# Altium project PicoHAL.PrjPCB
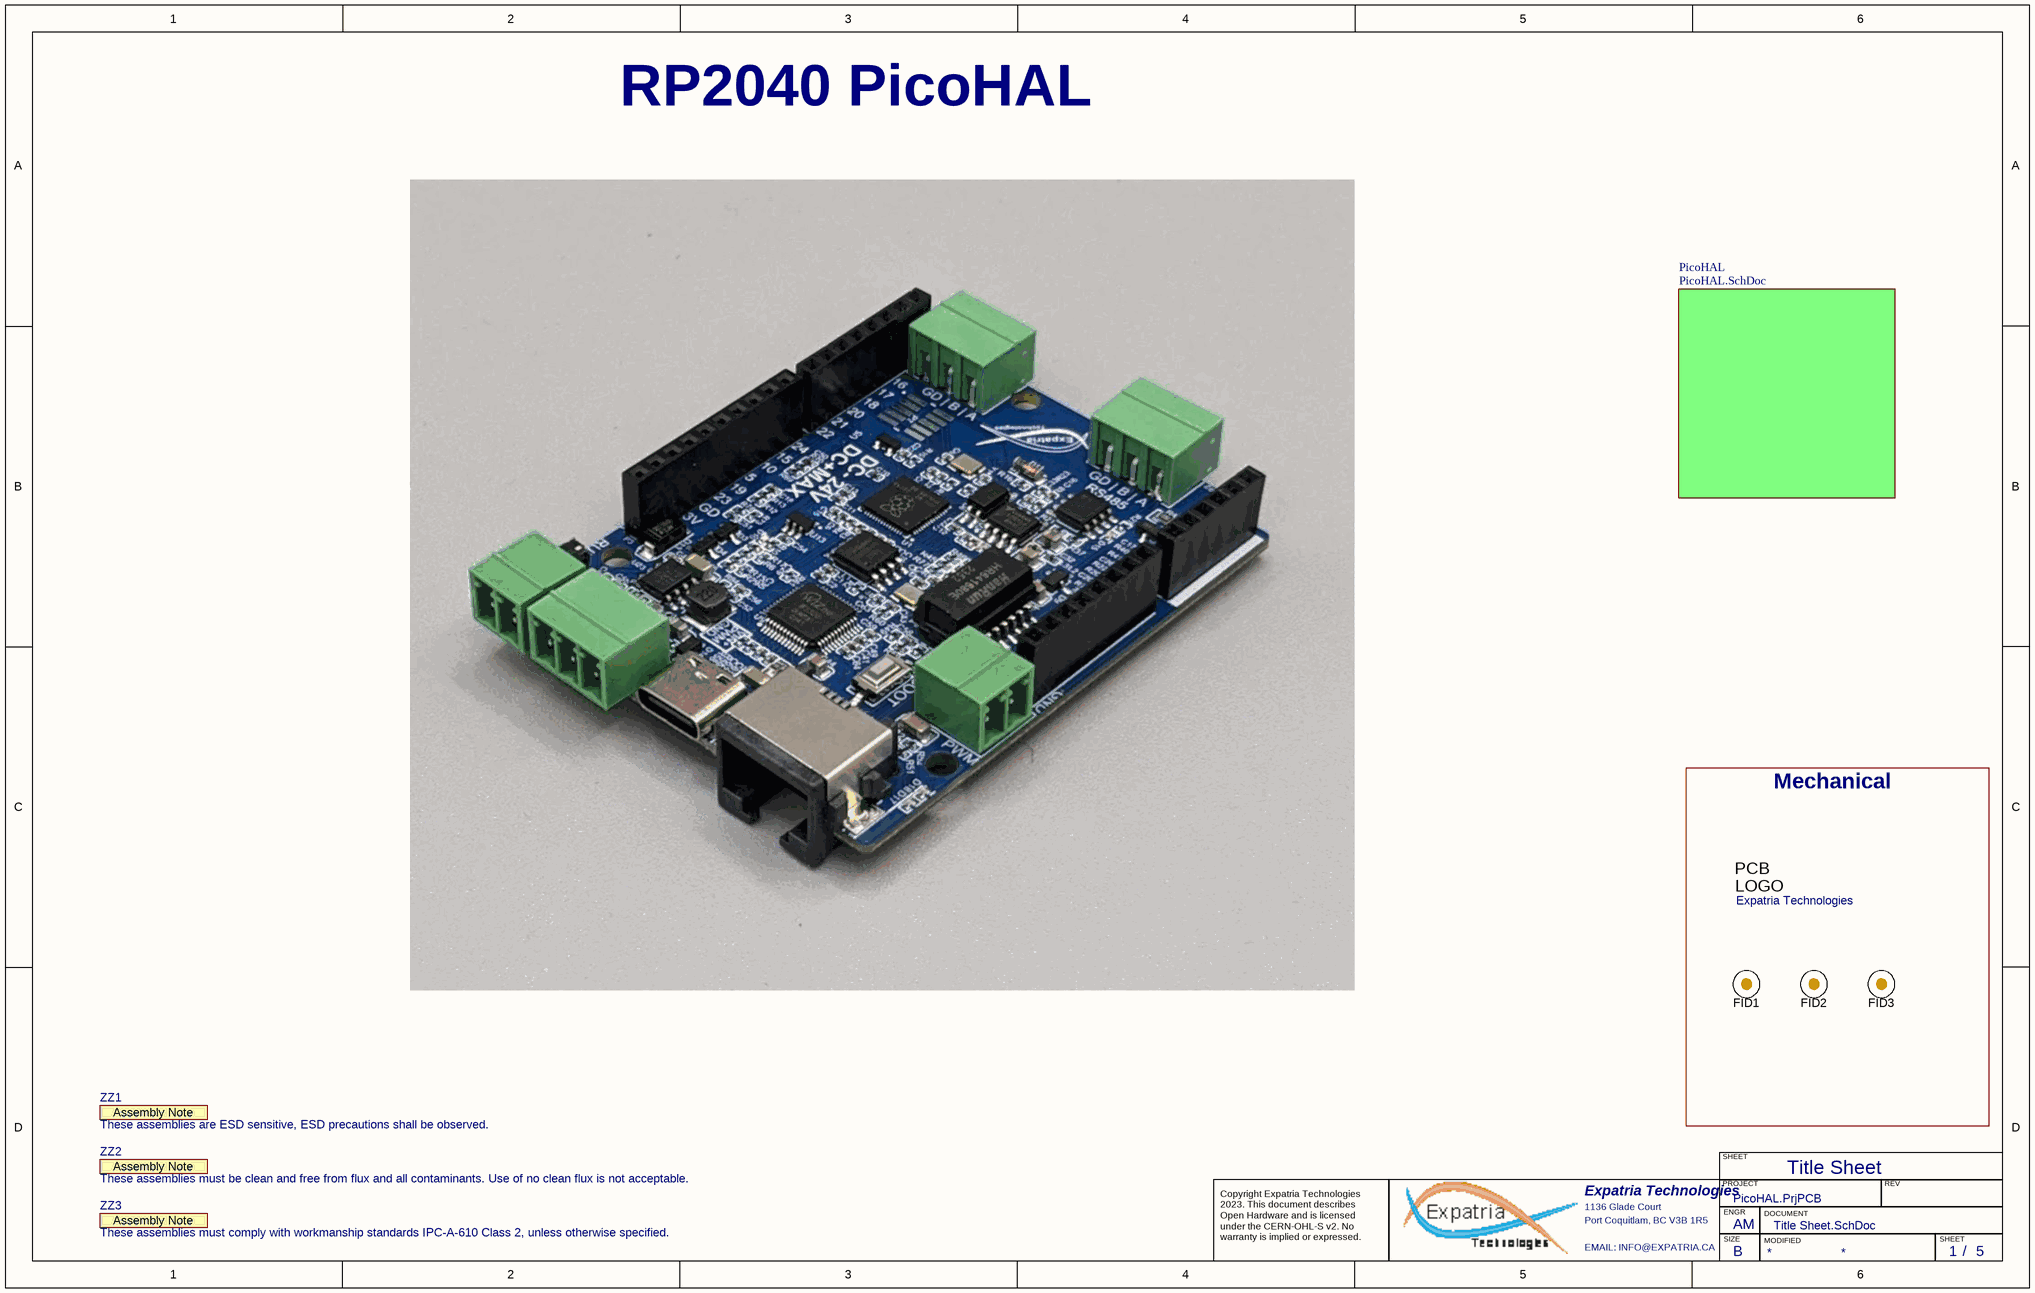
[diagram p0: Title Sheet.SchDoc]
VarRevNo: A10; Title: PicoHAL; PCBREVNO: A10; PCBPARTNO: PicoHAL
5 sheets, 178 parts. Net scope: hierarchical (ports join the sheet entries above them; power ports are global).
Board file: PicoHAL.pcbdoc
Sheets:
  Title Sheet.SchDoc
    PicoHAL = PicoHAL.SchDoc
      MODBUS = RS485.SchDoc
      5V_Supply = 5V_Power_Supply.SchDoc
      ET = W5500_Module.SchDoc

## Sheet Title Sheet.SchDoc: RP2040 CNC
size B; Author: AM; CompanyName: Expatria Technologies; DrawnBy: A.Marles; Engineer: AM; Organization: Expatria Technolgoies; Address1: Schematic; DocumentNumber: 1; Revision: A10; SheetNumber: 1; SheetTotal: 5

### Parts
FID1  Fiducial  [Fiducial10-20]  (value not drawn)  (no BOM)
FID2  Fiducial  [Fiducial10-20]  (value not drawn)  (no BOM)
FID3  Fiducial  [Fiducial10-20]  (value not drawn)  (no BOM)
Logo1  Expatria Technologies  [Expatria-Logo]  (no BOM)
ZZ1  These assemblies are ESD sensitive, ESD precautions shall be observed.  [AssemblyNote]  (graphical)
ZZ2  These assemblies must be clean and free from flux and all contaminants. Use of no clean flux is not acceptable.  [AssemblyNote]  (graphical)
ZZ3  These assemblies must comply with workmanship standards IPC-A-610 Class 2, unless otherwise specified.  [AssemblyNote]  (graphical)

### Blocks framed on the sheet
Mechanical: FID1-FID3 Logo1

### Sub-sheets
PicoHAL = PicoHAL.SchDoc: no entries

### Notes on the sheet
- RP2040 PicoHAL
- Title Sheet
- SHEET
- Expatria Technologies
- 1136 Glade Court
- Port Coquitlam, BC V3B 1R5
- PROJECT
- SIZE
- ENGR
- MODIFIED
- DOCUMENT
- REV
- Copyright Expatria Technologies 2023. This document describes Open Hardware and is licensed under the CERN-OHL-S v2. No warranty is implied or expressed.
- EMAIL: INFO@EXPATRIA.CA
- B
- /
- (in symbol AssemblyNote) Assembly Note
- (in symbol SBT-Logo) PCB; LOGO

### Library data of the parts
FID1-FID3 = Fiducial: FIDUCIAL NO ASSEMBLY; Manufacturer 1: NONE; Manufacturer Part Number 1: NONE; Value: Fiducial
Logo1 = SBT-Logo: Manufacturer 1: NONE; Value: Expatria Logo; Manufacturer Part Number 1: NONE
ZZ1-ZZ3 = AssemblyNote: SymbolCreator: codlsc; SymbolVersion: 2010-05-18; CompType: AssemblyNote; ClassName: AssemblyNote; Publisher: Texas Instruments; LatestRevisionDate: 2012-06-14; LatestRevisionNote: Initial Version; Alternate Manufacturer: -; Alternate PartNumber: -

## Sheet PicoHAL.SchDoc: RP2040 CNC
size C; Author: AM; CompanyName: Expatria Technologies; DrawnBy: A.Marles; Engineer: AM; Organization: Expatria Technolgoies; Address1: Schematic; DocumentNumber: 2; Revision: A10; SheetNumber: 2; SheetTotal: 5
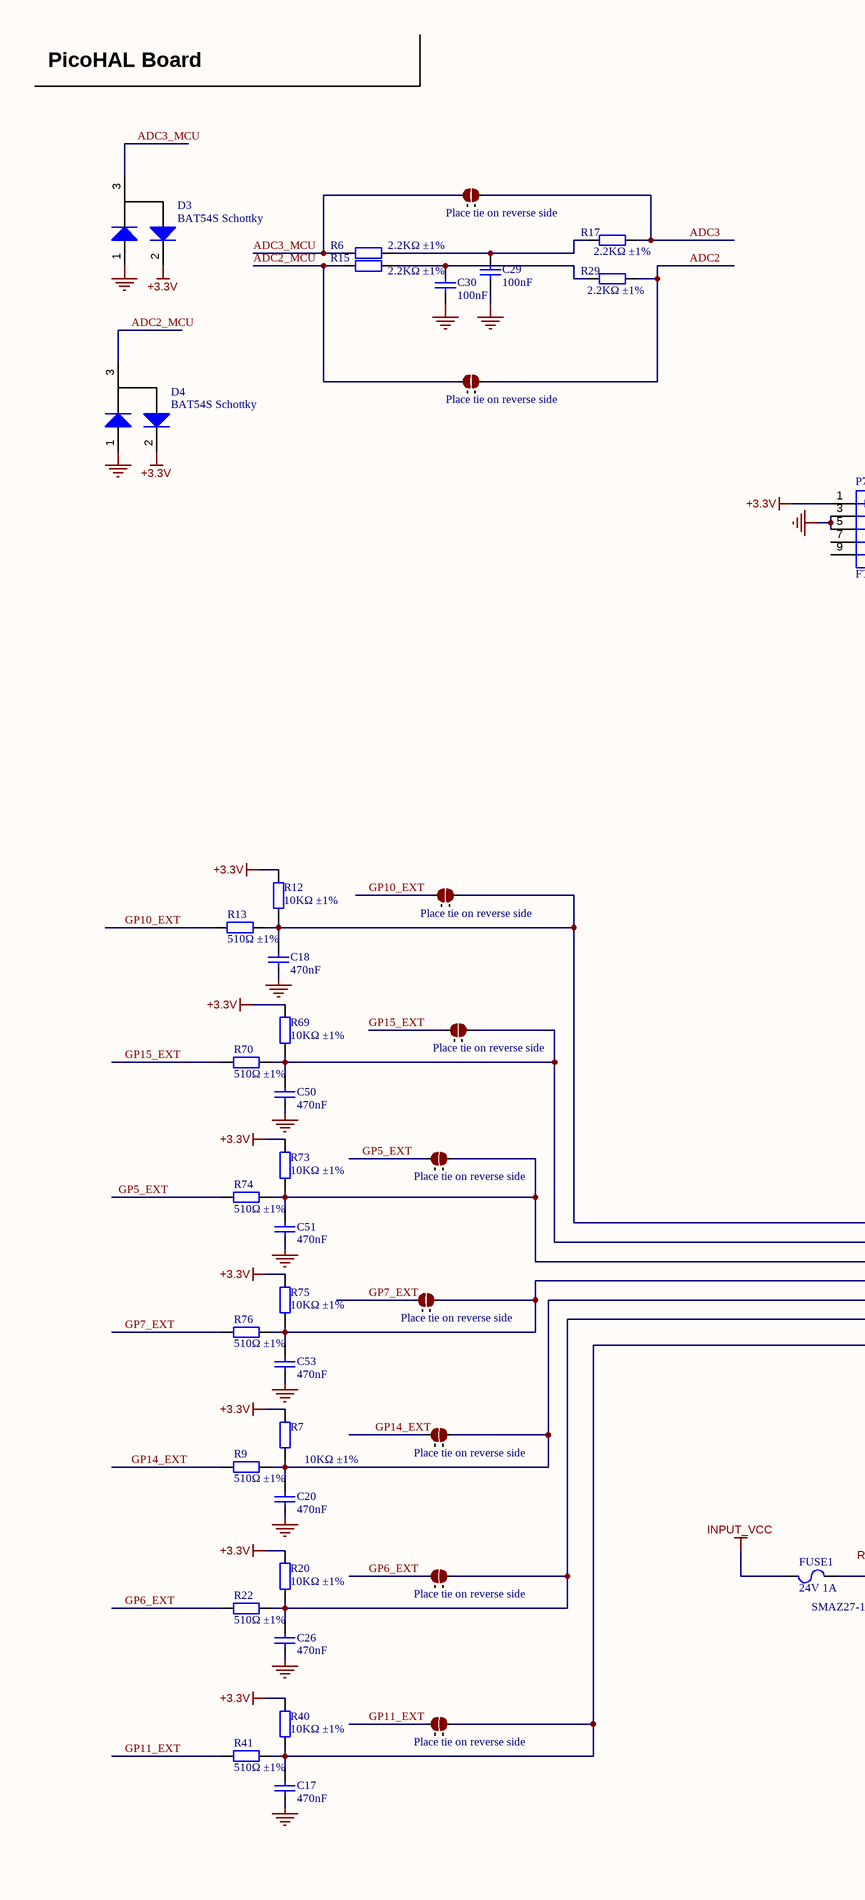
[diagram p1: PicoHAL.SchDoc, left]
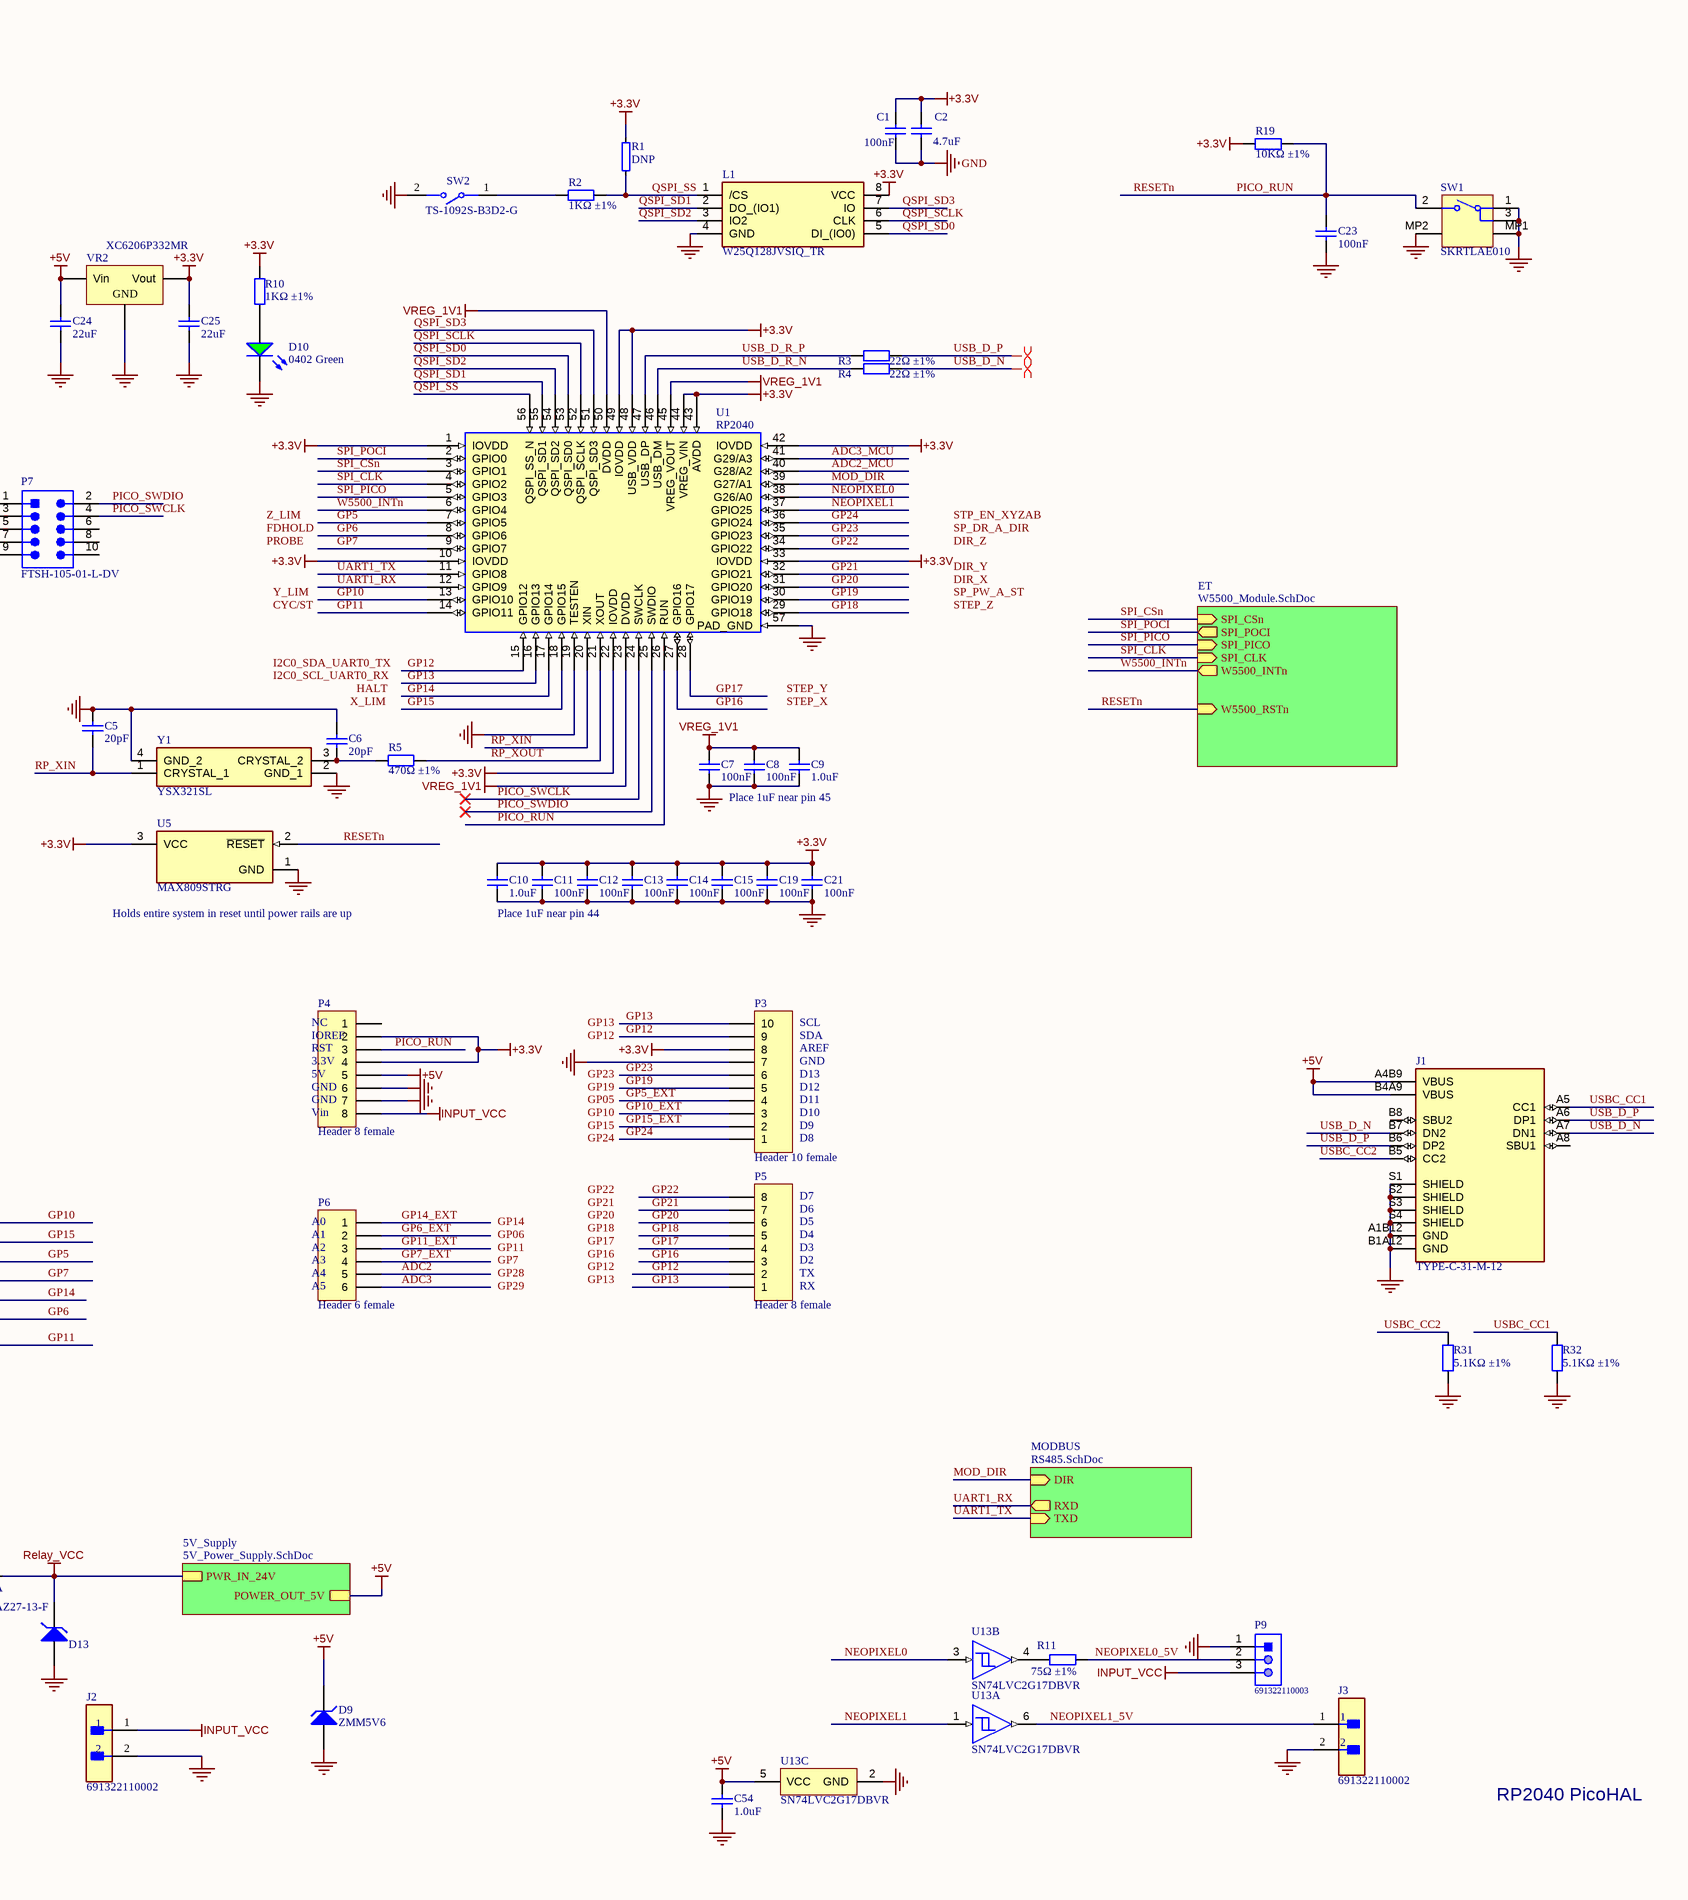
[diagram p2: PicoHAL.SchDoc, right]

### Parts
C1  100nF  [0402_C]
C2  4.7uF  [0402_C]
C5  20pF  [0402_C]
C6  20pF  [0402_C]
C7  100nF  [0402_C]
C8  100nF  [0402_C]
C9  1.0uF  [0402_C]
C10  1.0uF  [0402_C]
C11  100nF  [0402_C]
C12  100nF  [0402_C]
C13  100nF  [0402_C]
C14  100nF  [0402_C]
C15  100nF  [0402_C]
C17  470nF  [0402_C]
C18  470nF  [0402_C]
C19  100nF  [0402_C]
C20  470nF  [0402_C]
C21  100nF  [0402_C]
C23  100nF  [0402_C]
C24  22uF  [0805_C]
C25  22uF  [0805_C]
C26  470nF  [0402_C]
C29  100nF  [0402_C]
C30  100nF  [0402_C]
C50  470nF  [0402_C]
C51  470nF  [0402_C]
C53  470nF  [0402_C]
C54  1.0uF  [0402_C]
D3  BAT54S Schottky  [SOT-23(SOT-23-3)]
D4  BAT54S Schottky  [SOT-23(SOT-23-3)]
D9  ZMM5V6  [LL-34]
D10  0402 Green  [LED 0402_1005 RED]
D13  SMAZ27-13-F  [DIOM5226X240N]
FUSE1  24V 1A  [1206_C]
J1  TYPE-C-31-M-12  [HRO_TYPE-C-31-M-12]
J2  691322110002  [FP-691322110002-MFG]
J3  691322110002  [FP-691322110002-MFG]
J7  2 way net solder junction - Normally Open  [2waySolder_NO]  (value not drawn)  (no BOM)
J8  2 way net solder junction - Normally Open  [2waySolder_NO]  (value not drawn)  (no BOM)
J9  2 way net solder junction - Normally Open  [2waySolder_NO]  (value not drawn)  (no BOM)
J10  2 way net solder junction - Normally Open  [2waySolder_NO]  (value not drawn)  (no BOM)
J11  2 way net solder junction - Normally Open  [2waySolder_NO]  (value not drawn)  (no BOM)
J12  2 way net solder junction - Normally Open  [2waySolder_NO]  (value not drawn)  (no BOM)
J13  2 way net solder junction - Normally Open  [2waySolder_NO]  (value not drawn)  (no BOM)
J14  2 way net solder junction - Normally Open  [2waySolder_NO]  (value not drawn)  (no BOM)
J15  2 way net solder junction - Normally Open  [2waySolder_NO]  (value not drawn)  (no BOM)
L1  W25Q128JVSIQ_TR  [SOIC127P780X195-8N]
P3  Header 10 female  [HDR1X10]
P4  Header 8 female  [HDR1X8]
P5  Header 8 female  [HDR1X8]
P6  Header 6 female  [HDR1X6]
P7  FTSH-105-01-L-DV  [SMTC-FTSH-105-01-L-DV_V]  (no BOM)
P9  691322110003  [691322110003]
R1  DNP  [0402]
R2  1KΩ ±1%  [0402_R]
R3  22Ω ±1%  [0402_R]
R4  22Ω ±1%  [0402_R]
R5  470Ω ±1%  [0402_R]
R6  2.2KΩ ±1%  [0402_R]
R7  10KΩ ±1%  [0402_R]
R9  510Ω ±1%  [0402_R]
R10  1KΩ ±1%  [0402_R]
R11  75Ω ±1%  [0402_R]
R12  10KΩ ±1%  [0402_R]
R13  510Ω ±1%  [0402_R]
R15  2.2KΩ ±1%  [0402_R]
R17  2.2KΩ ±1%  [0402_R]
R19  10KΩ ±1%  [0402_R]
R20  10KΩ ±1%  [0402_R]
R22  510Ω ±1%  [0402_R]
R29  2.2KΩ ±1%  [0402_R]
R31  5.1KΩ ±1%  [0402_R]
R32  5.1KΩ ±1%  [0402_R]
R40  10KΩ ±1%  [0402_R]
R41  510Ω ±1%  [0402_R]
R69  10KΩ ±1%  [0402_R]
R70  510Ω ±1%  [0402_R]
R73  10KΩ ±1%  [0402_R]
R74  510Ω ±1%  [0402_R]
R75  10KΩ ±1%  [0402_R]
R76  510Ω ±1%  [0402_R]
SW1  SKRTLAE010  [ALPS-SKRTLAE010_V]
SW2  TS-1092S-B3D2-G  [SW-SMD_L6.1-W3.6-LS7.9]
U1  RP2040  [RP2040]
U5  MAX809STRG  [FP-318-08-MFG]
U13  SN74LVC2G17DBVR  [DBV0006A_N]  (parts A,B,C of 3)
VR2  XC6206P332MR  [SOT-23-3L]
Y1  YSX321SL  [YSX321SL]

### Sub-sheets
5V_Supply = 5V_Power_Supply.SchDoc: POWER_OUT_5V, PWR_IN_24V
ET = W5500_Module.SchDoc: SPI_CSn (in), SPI_POCI (out), W5500_RSTn (in), SPI_CLK (in), SPI_PICO (in), W5500_INTn (out)
MODBUS = RS485.SchDoc: RXD (out), TXD (in), DIR (in)

### Nets
+3.3V: C1.2 C2.2 C10.2 C11.2 C12.2 C13.2 C14.2 C15.2 C19.2 C21.2 C25.2 D3.2(A) D4.2(A) L1.8(VCC) P3.8 P4.2 P4.4 P7.1 R1.2 R7.2 R10.2 R12.2 R19.2 R20.2 R40.2 R69.2 R73.2 R75.2 U1.1(IOVDD) U1.10(IOVDD) U1.22(IOVDD) U1.33(IOVDD) U1.42(IOVDD) U1.43(AVDD) U1.44(VREG_VIN) U1.48(USB_VDD) U1.49(IOVDD) U5.3(VCC) VR2.2(Vout)
+5V: C24.2 C54.1 D9.2(K) J1.A4B9(VBUS) J1.B4A9(VBUS) P4.5 U13.5(VCC) VR2.3(Vin) ; sheet 5V_Supply/POWER_OUT_5V
GND: C1.1 C2.1 C5.2 C6.2 C7.1 C8.1 C9.1 C10.1 C11.1 C12.1 C13.1 C14.1 C15.1 C17.1 C18.1 C19.1 C20.1 C21.1 C23.1 C24.1 C25.1 C26.1 C29.1 C30.1 C50.1 C51.1 C53.1 C54.2 D3.1(A) D4.1(A) D9.1(A) D10.K D13.1(A) J1.A1B12(GND) J1.B1A12(GND) J1.S1(SHIELD) J1.S2(SHIELD) J1.S3(SHIELD) J1.S4(SHIELD) J2.2 J3.2 L1.4(GND) P3.7 P4.6 P4.7 P7.3 P7.5 P9.1 R31.2 R32.2 SW1.1 SW1.3 SW1.MP1 SW1.MP2 SW2.2 U1.19(TESTEN) U1.57(PAD_GND) U5.1(GND) U13.2(GND) VR2.1(GND) Y1.2(GND_1) Y1.4(GND_2)
INPUT_VCC: FUSE1.1 J2.1 P4.8 P9.3
Relay_VCC: D13.2(K) FUSE1.2 ; sheet 5V_Supply/PWR_IN_24V
VREG_1V1: C7.2 C8.2 C9.2 U1.23(DVDD) U1.45(VREG_VOUT) U1.50(DVDD)
ADC2: J8.2 P6.5 R29.2
ADC2_MCU: D4.3(K) J8.1 R15.1 U1.40(G28/A2)
ADC3: J7.2 P6.6 R17.2
ADC3_MCU: D3.3(K) J7.1 R6.1 U1.41(G29/A3)
GP5: C51.2 J11.2 R73.1 R74.2 U1.7(GPIO5)
GP5_EXT: J11.1 P3.4 R74.1
GP6: C26.2 J14.2 R20.1 R22.2 U1.8(GPIO6)
GP6_EXT: J14.1 P6.2 R22.1
GP7: C53.2 J12.2 R75.1 R76.2 U1.9(GPIO7)
GP7_EXT: J12.1 P6.4 R76.1
GP10: C18.2 J9.2 R12.1 R13.2 U1.13(GPIO10)
GP10_EXT: J9.1 P3.3 R13.1
GP11: C17.2 J15.2 R40.1 R41.2 U1.14(GPIO11)
GP11_EXT: J15.1 P6.3 R41.1
GP12: P3.9 P5.2 U1.15(GPIO12)
GP13: P3.10 P5.1 U1.16(GPIO13)
GP14: C20.2 J13.2 R7.1 R9.2 U1.17(GPIO14)
GP14_EXT: J13.1 P6.1 R9.1
GP15: C50.2 J10.2 R69.1 R70.2 U1.18(GPIO15)
GP15_EXT: J10.1 P3.2 R70.1
GP16: P5.3 U1.27(GPIO16)
GP17: P5.4 U1.28(GPIO17)
GP18: P5.5 U1.29(GPIO18)
GP19: P3.5 U1.30(GPIO19)
GP20: P5.6 U1.31(GPIO20)
GP21: P5.7 U1.32(GPIO21)
GP22: P5.8 U1.34(GPIO22)
GP23: P3.6 U1.35(GPIO23)
GP24: P3.1 U1.36(GPIO24)
MOD_DIR: U1.39(G27/A1) ; sheet MODBUS/DIR
NEOPIXEL0: U1.38(G26/A0) U13.3(2A)
NEOPIXEL0_5V: P9.2 R11.1
NEOPIXEL1: U1.37(GPIO25) U13.1(1A)
NEOPIXEL1_5V: J3.1 U13.6(1Y)
PICO_RUN: C23.2 P4.3 R19.1 SW1.2 U1.26(RUN) U5.2(~{RESET}) ; sheet ET/W5500_RSTn  [also labelled RESETn]
PICO_SWCLK: P7.4 U1.24(SWCLK)
PICO_SWDIO: P7.2 U1.25(SWDIO)
QSPI_SCLK: L1.6(CLK) U1.52(QSPI_SCLK)
QSPI_SD0: L1.5(DI_(IO0)) U1.53(QSPI_SD0)
QSPI_SD1: L1.2(DO_(IO1)) U1.55(QSPI_SD1)
QSPI_SD2: L1.3(IO2) U1.54(QSPI_SD2)
QSPI_SD3: L1.7(IO) U1.51(QSPI_SD3)
QSPI_SS: L1.1(/CS) R1.1 R2.2 U1.56(QSPI_SS_N)
RP_XIN: C5.1 U1.20(XIN) Y1.1(CRYSTAL_1)
RP_XOUT: R5.2 U1.21(XOUT)
SPI_CLK: U1.4(GPIO2) ; sheet ET/SPI_CLK
SPI_CSn: U1.3(GPIO1) ; sheet ET/SPI_CSn
SPI_PICO: U1.5(GPIO3) ; sheet ET/SPI_PICO
SPI_POCI: U1.2(GPIO0) ; sheet ET/SPI_POCI
UART1_RX: U1.12(GPIO9) ; sheet MODBUS/RXD
UART1_TX: U1.11(GPIO8) ; sheet MODBUS/TXD
USB_D_N: J1.A7(DN1) J1.B7(DN2) R4.1
USB_D_P: J1.A6(DP1) J1.B6(DP2) R3.1
USB_D_R_N: R4.2 U1.46(USB_DM)
USB_D_R_P: R3.2 U1.47(USB_DP)
USBC_CC1: J1.A5(CC1) R32.1
USBC_CC2: J1.B5(CC2) R31.1
W5500_INTn: U1.6(GPIO4) ; sheet ET/W5500_INTn
NetC6_1: C6.1 R5.1 Y1.3(CRYSTAL_2)
NetC29_2: C29.2 R6.2 R17.1
NetC30_2: C30.2 R15.2 R29.1
NetD10_A: D10.A R10.1
NetR2_1: R2.1 SW2.1
NetR11_2: R11.2 U13.4(2Y)

Not connected (* = marked no-connect by the designer): J1 A8(SBU1) B8(SBU2); P4 1; P7 6 7 8 9 10

### Layout directives
differential pair: USB_D_N, USB_D_P

### Notes on the sheet
- PicoHAL Board
- Place tie on reverse side
- (near J8) Place tie on reverse side
- Place 1uF near pin 45
- (near J9) Place tie on reverse side
- (near U5) Holds entire system in reset until power rails are up
- Place 1uF near pin 44
- (near J10) Place tie on reverse side
- (near P4) NC
- (near P4) IOREF
- (near P4) RST
- GP13
- GP12
- (near P3) AREF
- (near P3) SDA
- (near P3) SCL
- (near P4) 3.3V
- (near P4) 5V
- (near P4) GND
- GP23
- GP19
- GP05
- (near P3) GND
- (near P3) D13
- (near P3) D12
- (near P3) D11
- (near J11) Place tie on reverse side
- (near P4) Vin
- GP10
- GP15
- GP24
- (near P3) D10
- (near P3) D9
- D8
- (near P6) A0
- (near P6) A1
- GP14
- GP06
- GP22
- GP21
- GP20
- GP18
- D7
- (near P5) D6
- (near P5) D5
- (near P5) D4
- (near P6) A2
- (near P6) A3
- (near P6) A4
- (near P6) A5
- GP11
- GP7
- GP28
- GP29
- GP17
- GP16
- (near P5) D3
- (near P5) D2
- (near P5) TX
- (near P5) RX
- (near J12) Place tie on reverse side
- (near J13) Place tie on reverse side
- (near J14) Place tie on reverse side
- (near J15) Place tie on reverse side
- RP2040 PicoHAL
- Labels drawn without touching a wire or pin: CYC/ST, DIR_X, DIR_Y, DIR_Z, FDHOLD, HALT, I2C0_SCL_UART0_RX, I2C0_SDA_UART0_TX, PROBE, SP_DR_A_DIR, SP_PW_A_ST, STEP_X, STEP_Y, STEP_Z, STP_EN_XYZAB, X_LIM, Y_LIM, Z_LIM
- Expatria Technologies
- SHEET
- PROJECT
- REV
- 1136 Glade Court
- Port Coquitlam, BC V3B 1R5
- EMAIL: INFO@EXPATRIA.CA
- SIZE
- ENGR
- C
- MODIFIED
- DOCUMENT
- /
- Copyright Expatria Technologies 2023. This document describes Open Hardware and is licensed under the CERN-OHL-S v2. No warranty is implied or expressed.

### Library data of the parts
C1 C7 C8 C11-C15 C19 C21 C23 C29 C30 = 0402 100nF (104) 10% 16V: Chip capacitors; Manufacturer: Samsung Electro-Mechanics; PartNumber: CL05B104KO5NNNC; Tolerance: 10%; Voltage: 16V; ComponentLink1Description: Supplier link; ComponentLink1URL: http://www.szlcsc.com/product/details_1877.html; Package: 0402; Supplier: LC; SuppliersPartNumber: C1525; Capacitance: 100nF
C2 = 0402 4.7uF (475) 20% 10V: Chip capacitor; Manufacturer: Samsung Electro-Mechanics; PartNumber: CL05A475MP5NRNC; Tolerance: 20%; Voltage: 10V; ComponentLink1Description: Supplier link; ComponentLink1URL: http://www.szlcsc.com/product/details_24469.html; Package: 0402; Supplier: LC; SuppliersPartNumber: C23733; Capacitance: 4.7uF
C5 C6 = 0402 20pF (200) 5% 50V: Chip capacitors; Manufacturer: Guangdong Fenghua Advanced Tech; PartNumber: 0402CG200J500NT; Tolerance: 5%; Voltage: 50V; ComponentLink1Description: Supplier link; ComponentLink1URL: http://www.szlcsc.com/product/details_1906.html; Package: 0402; Supplier: LC; SuppliersPartNumber: C1554; Capacitance: 20pF
C9 C10 C54 = 0402 1.0uF (105) 10% 25V: Chip capacitor; Manufacturer: Samsung Electro-Mechanics; PartNumber: CL05A105KA5NQNC; Capacitance: 1uF; Tolerance: 10%; Voltage: 25V; ComponentLink1Description: Supplier link; ComponentLink1URL: http://www.szlcsc.com/product/details_53938.html; Package: 0402; Supplier: LC; SuppliersPartNumber: C52923
C17 C18 C20 C26 C50 C51 C53 = 0402 470nF (474) 10% 10V: Chip capacitors; Manufacturer: Samsung Electro-Mechanics; PartNumber: CL05A474KP5NNNC; Tolerance: 10%; Voltage: 10V; ComponentLink1Description: Supplier link; ComponentLink1URL: http://www.szlcsc.com/product/details_48344.html; Package: 0402; Supplier: LC; SuppliersPartNumber: C47339; Capacitance: 470nF
C24 C25 = 0805 22uF (226) 20% 25V: Chip capacitors; Manufacturer: Samsung Electro-Mechanics; PartNumber: CL21A226MAQNNNE; Tolerance: 20%; Voltage: 25V; Package: 0805; Supplier: LC; SuppliersPartNumber: C2922481; Capacitance: 22uF; ComponentLink1Description: Supplier link; ComponentLink1URL: http://www.szlcsc.com/product/details_46786.html
D3 D4 = SOT-23 BAT54S: 30V Dual 200mA 800mV@100mA SOT-23 Schottky Barrier Diodes (SBD) ROHS; ComponentLink1Description: 供应商链接; ComponentLink1URL: http://www.szlcsc.com/product/details_2877.html; Package: SOT-23; Supplier: LC; SuppliersPartNumber: C916425
D9 = LL-34 ZMM5V6: 500mW - 0.1uA @ 1V 5.6V LL-34 Zener Diodes ROHS; ComponentLink1Description: 供应商链接; ComponentLink1URL: http://www.szlcsc.com/product/details_8541.html; Package: LL-34; Supplier: LC; SuppliersPartNumber: C8062
D10 = 0402 LED Green: LED; Package: 0402; Supplier: LC; SuppliersPartNumber: C130723; Color: Green
D13 = BZT52C27: 27V ±5% 1W 500nA @ 20.5V SMA(DO-214AC) Zener Diodes RoHS; ComponentLink1Description: 供应商链接; ComponentLink1URL: http://www.szlcsc.com/product/details_8541.html; Package: SMA(DO-214AC); Supplier: LC; SuppliersPartNumber: C155318
FUSE1 = JK-nSMD050-24: 24V 1A 0.1s 1206 PTC Resettable Fuses RoHS; Manufacturer: Jinrui Electronic Materials Co.; Package: 1206; Supplier: LC; SuppliersPartNumber: C369160; PartNumber: JK-nSMD050-24
J1 = TYPE-C-31-M-12: USB Connectors 24 Receptacle 1 8.94*7.3mm RoHS; MF: HRO Electronics Co., Ltd.; Value: *; SnapEDA_Link: https://www.snapeda.com/parts/TYPE-C-31-M-12/HRO%20Electronics%20Co.,%20Ltd./view-part/3228496/?ref=snap; Package: Package; MP: TYPE-C-31-M-12; Price: None; Availability: Unavailable; SuppliersPartNumber: C165948
J2 = CMP-1502-01791-2: TERM BLOCK HDR 2POS 90DEG 3.5MM; Voltage: 300V; Current: 10A; Number of Levels: 1; Number of Positions: 2; Length: 10.5mm; Pitch: 3.5mm; Color: Green; Mount: Through Hole; Package Quantity: 1000; Series: WR-TBL Series 3221; Contact Material: Brass; RoHS Compliant: Yes; Width: 8.1mm; Housing Material: Nylon; Flammability Rating: UL94 V-0; Lead Free: Lead Free; Termination: Solder; Number of Contacts: 2; Packaging: Bulk; Number of Rows: 1; Height: 9.2mm; Number of Positions Per Level: 2; SuppliersPartNumber: C395830
J3 = CMP-1502-01791-2: TERM BLOCK HDR 2POS 90DEG 3.5MM; SuppliersPartNumber: C880572
J7-J15 = 2waySolderNO: ComponentLink1URL: http://www.edatools.cz/addons; ComponentLink1Description: Source
L1 = W25Q128JVSIQ_TR: Inductor; Manufacturer_Name: Winbond; Manufacturer_Part_Number: W25Q128JVSIQ TR; Datasheet Link: http://www.winbond.com/resource-files/w25q128jv%20spi%20revc%2011162016.pdf; Height: 1.95mm; Mouser Part Number: 454-W25Q128JVSIQTR; Mouser Price/Stock: https://www.mouser.co.uk/ProductDetail/Winbond/W25Q128JVSIQ-TR?qs=qSfuJ%252Bfl%2Fd7vTyLA9kNdGw%3D%3D; Arrow Part Number: W25Q128JVSIQ TR; Arrow Price/Stock: https://www.arrow.com/en/products/w25q128jvsiqtr/winbond-electronics?region=nac; SuppliersPartNumber: C97521
P3 = Header 10: Header, 10-Pin; LatestRevisionDate: 17-Jul-2002; LatestRevisionNote: Re-released for DXP Platform.; Publisher: Altium Limited; SuppliersPartNumber: C2905418
P4 P5 = Header 8: Header, 8-Pin; LatestRevisionDate: 17-Jul-2002; LatestRevisionNote: Re-released for DXP Platform.; Publisher: Altium Limited; SuppliersPartNumber: C27438
P6 = Header 6: Header, 6-Pin; LatestRevisionDate: 17-Jul-2002; LatestRevisionNote: Re-released for DXP Platform.; Publisher: Altium Limited; SuppliersPartNumber: C40877
P7 = CMP-2000-05354-1: Male Header, Pitch 1.27 mm, 2 x 5 Position, Height 5.96 mm, -55 to 125 degC, RoHS, Bulk; Manufacturer: Samtec; Connector Type: Header,Unshrouded; Pitch: 0.050"(1.27mm); Mating Products: FLE-105-01-G-DV-TR-ND-CONNSKT1.27MM10POSDUALSMDCLP-105-02-G-D-P-TR-ND-CONNRCPT10POSDUAL.05"SMDSFMC-105-L2-S-D-TR-ND-CONN.05"SURFACE10POSSMTSFMH-105-02-L-D-TR-ND-CONNRECEPT10POS.50"SMTFLE-105-01-G-DV-A-ND-CONNSKT1.27MM10POSDUALSMDCLP-105-02-G-D-BE-ND-CONNRCPT10POSDUAL.05"SMDFLE-105-01-G-DV-A-P-ND-CONNSKT1.27MM10POSDUALSMDSAM1153-05-ND-CONNRCPT10POSDUAL.05"SMDSAM1155-05-ND-CONNRCPT10POSDUAL.05"SMDSAM1154-05-ND-CONNRCPT10POSDUAL.05"SMDSFMH-105-02-L-D-LC-ND-CONNRECEPT10POS.50"SMTSAM1226-05-ND-CONNRCPT.05"10POSDUALSMD; Catalog Drawings: FTSHSeriesFTSHSeriesSMTSide; Other Names: SAM1161-05; EDA / CAD Models: DownloadfromAcceleratedDesigns; Number of Positions Loaded: All; Number of Positions: 10; Featured Product: Board-To-BoardInterconnectSystems; Online Catalog: FTSHSeries; Product Training Modules: Board-to-BoardConnectors; Category: Connectors,Interconnects; Number of Rows: 2; Contact Finish: Gold; Termination: Solder; Mounting Type: SurfaceMount; Series: FTSH; Contact Mating Length: 0.120"(3.05mm); Row Spacing: 0.050"(1.27mm); Datasheet URL: https://datasheet.ciiva.com/30493/0900766b80adfe36-30493006.pdf; Contact Finish Thickness: 10µin(0.25µm); Features: -; Standard Package: 1; Packaging: Bulk; Datasheet Version: Feb-08; Manufacturer URL: http://www.samtec.com/; Fastening Type: -; Family: RectangularConnectors-Headers,MalePins; Contact Type: MalePin; Color: Black
P9 = CMP-1502-01792-1: Serie 3221 - 3.50mm Horizontal PCB Header WR-TBL, 3 pin; SuppliersPartNumber: C880573
R1 = RES: Resistor, ±5%, 0.05W; Part Number: R0201-0R; Part number IPS: 00000003245; Value: 0R; Note: Chip Res 5%; Artikkelnr Noca: N.A.; Manufacturer: *; Manufacturer Part Number: *; ComponentLink1URL: *; ComponentLink1Description: Datasheet; ComponentLink2URL: *; ComponentLink2Description: Supplier link; HelpURL: *; Footprint Doc: 0201; LatestRevisionDate: 2017-11-09; Pin Count: 2; Publisher: Nordic Semiconductor; Published: 2014-11-13; Supplier 1: *; Supplier Part Number 1: *; Supplier 2: *; Supplier Part Number 2: *
R2 R10 = 0402 1K (1001) 1%: Chip resistor; Manufacturer: Uniroyal Elec; PartNumber: 0402WGF1001TCE; Power: 1/16W; ComponentLink1Description: Supplier link; ComponentLink1URL: http://www.szlcsc.com/product/details_12256.html; Package: 0402; Supplier: LC; SuppliersPartNumber: C11702; Resistance: 1KΩ; Tolerance: 1%
R3 R4 = 0402 22R (22R0) 1%: Chip resistor; Manufacturer: Uniroyal Elec; PartNumber: 0402WGF220JTCE; Power: 1/16W; ComponentLink1Description: Supplier link; ComponentLink1URL: http://www.szlcsc.com/product/details_25835.html; Package: 0402; Supplier: LC; SuppliersPartNumber: C25092; Resistance: 22Ω; Tolerance: 1%
R5 = 0402 470R (4700) 1%: Chip resistor; Manufacturer: Uniroyal Elec; PartNumber: 0402WGF4700TCE; Power: 1/16W; ComponentLink1Description: Supplier link; ComponentLink1URL: http://www.szlcsc.com/product/details_25860.html; Package: 0402; Supplier: LC; SuppliersPartNumber: C25117; Resistance: 470Ω; Tolerance: 1%
R6 R15 R17 R29 = 0402 2.2K (2201) 1%: Chip resistor; Manufacturer: Uniroyal Elec; PartNumber: 0402WGF2201TCE; Power: 1/16W; ComponentLink1Description: Supplier link; ComponentLink1URL: http://www.szlcsc.com/product/details_26622.html; Package: 0402; Supplier: LC; SuppliersPartNumber: C25879; Resistance: 2.2KΩ; Tolerance: 1%
R7 R12 R19 R20 R40 R69 R73 R75 = 0402 10K (1002) 1%: Chip resistor; Manufacturer: Uniroyal Elec; PartNumber: 0402WGF1002TCE; Power: 1/16W; ComponentLink1Description: Supplier link; ComponentLink1URL: http://www.szlcsc.com/product/details_26487.html; Package: 0402; Supplier: LC; SuppliersPartNumber: C25744; Resistance: 10KΩ; Tolerance: 1%
R9 R13 R22 R41 R70 R74 R76 = 0402 510R (5100) 1%: Chip resistor; Manufacturer: Uniroyal Elec; PartNumber: 0402WGF5100TCE; Power: 1/16W; ComponentLink1Description: Supplier link; ComponentLink1URL: http://www.szlcsc.com/product/details_25866.html; Package: 0402; Supplier: LC; SuppliersPartNumber: C25123; Resistance: 510Ω; Tolerance: 1%
R11 = 0402 75R (75R0) 1%: Chip resistor; Manufacturer: Uniroyal Elec; PartNumber: 0402WGF750JTCE; Power: 1/16W; ComponentLink1Description: Supplier link; ComponentLink1URL: http://www.szlcsc.com/product/details_25876.html; Package: 0402; Supplier: LC; SuppliersPartNumber: C25133; Resistance: 75Ω; Tolerance: 1%
R31 R32 = 0402 5.1K (5101) 1%: Chip resistor; Manufacturer: Uniroyal Elec; PartNumber: 0402WGF5101TCE; Power: 1/16W; Resistance: 51.1KΩ; ComponentLink1Description: Supplier link; ComponentLink1URL: http://www.szlcsc.com/product/details_26648.html; Package: 0402; Supplier: LC; SuppliersPartNumber: C25905; Tolerance: 1%
SW1 = CMP-2000-07073-2: Side Push Type, 250 V, -40 to 90 degC, 3-Pin SMD, RoHS, Tape and Reel; Manufacturer: ALPS; Operating Force: 1.6N; Folder: Unified Components\Components\New Releases\New\; Maximum Current Rating: 0.05@12VDCA; RevisionId: 1; Pole Throw Configuration: SPST; Switch Configuration: N.O.; AccessRights: 2147483647; Maximum DC Voltage Rating: 12V; ContentType: Unified Component; Rad Hard: No; Mounting: SurfaceMount; Datasheet URL: http://www.alps.com/prod/info/E/PDF/Tact/SurfaceMount/SKRT/SKRT.PDF; Manufacturer URL: http://www.alps.com/e/; ReleaseDate: 22/09/2017 06:13:25 AM; ItemHRID: CMP-2000-07073; ContentTypeGUID: CB3C11C4-E317-11DF-B822-12313F0024A2; LifeCycle: Released; ItemGUID: EAC55BEC-37DC-4BDB-8BA7-D75E6D5C3D75; Packaging: Tape&Reel; Package Reference: SKRTLAE010; FolderGUID: B7F4506A-9127-42E7-A087-46FE7B18D116; Datasheet Version: 06/2015; Mounting Technology: SurfaceMount; LifeCycleStateGUID: 61E382EE-6656-4F12-9E24-BE9327104A25; Package Description: 3-Pin Surface Mount Device, Body 4.5 x 3.55 mm, Pitch 1.225 mm; SuppliersPartNumber: C110293
SW2 = TS-1092S-B3D2-G: Tactile Switches  3.6mm 2.5mm Rectangle button Brick nogging SPST 6.1mm 250gf SMD ROHS; Manufacturer 1: Yuandi; Width: 3.5mm; Size: 6.1mm; Manufacturer Part Number 1: TS-1092S-B3D2-G; SuppliersPartNumber: C520860
U1 = RP2040: RP2040 First MCU from RPI; SuppliersPartNumber: C2040
U5 = CMP-07130-000007-1: IC MPU SUPERVISORY 2.93V SOT23; Manufacturer: ON SEMICONDUCTOR; Number Of Outputs: 1; Nominal Supply Current: 0.5-0.8uA; Min Supply Voltage: 1V; Max Junction Temp: +125°C; Max Supply Voltage: 5.5V; Reset Timeout: 10us; Output Current: 20mA; Output Voltage: 0.3V; Reset Type: Active Low; Standoff Height: 0.01mm; Octopart: https://octopart.com/max809strg-on+semiconductor-509853; Category: IC; Temperature: -40°C to +125°C; Temperature Range Low: -40°C; ComponentLink2URL: https://www.onsemi.cn/PowerSolutions/document/MAX809S-D.PDF; Device Class L1: Integrated Circuits (ICs); Automotive: No; Package: 318-08; Device Class L2: Power Management ICs; RoHS: TRUE; Height: 1.11mm; Digikey Description: IC MPU SUPERVISORY 2.93V SOT23; Mouser Description: Supervisory Circuits 2.93V uP Reset; ComponentLink2Description: Datasheet; Manufacturer Part Number: MAX809STRG; Temperature Range High: +125°C; Number Of Rails Monitored: 1; Threshold Voltage: 2.93V; Footprint Url: https://www.onsemi.com/pub/Collateral/318-08.PDF; Device Class L3: Voltage Supervisors; Lead Free: Yes; SuppliersPartNumber: C9965
U13 = CMP-0859-00225-4: Dual Schmitt-Trigger Buffer, DBV0006A, LARGE T&R; Manufacturer: Texas Instruments; F @ Nom Voltage(Max)(Mhz): 150; VCC(Max)(V): 5.5; tpd @ Nom Voltage(Max)(ns): 9.3,5.7,5.4,4.3; Sub-Family: Non-Inverting Buffer/Driver; Output Drive (IOL/IOH)(Max)(mA): 32/-32; Output Type: CMOS; Voltage(Nom)(V): 1.8,2.5,3.3,5; ICC @ Nom Voltage(Max)(mA): 0.01; Schmitt Trigger: Yes; Technology Family: LVC; VCC(Min)(V): 1.65; 3-State Output: No; Rating: Catalog; Bits(#): 2; Input Type: CMOS/TTL; Logic: True; DatasheetVersion: SCES381N; Generic Part Number: SN74LVC2G17; PackageReference: DBV0006A; Operating Temperature Range(C): -40 to 125,-40 to 85; SuppliersPartNumber: C10429
VR2 = SOT-23 XC6206P332MR: 200mA 680mV@(100mA) Fixed 3.3V~3.3V Positive 1 6V SOT-23-3L Linear Voltage Regulators (LDO) ROHS; ComponentLink1Description: 供应商链接; ComponentLink1URL: http://www.szlcsc.com/product/details_5896.html; Package: SOT-23; Supplier: LC; SuppliersPartNumber: C5446
Y1 = YSX321SL: Crystal or Oscillator; Manufacturer_Name: YXC; Datasheet Link: https://datasheet.lcsc.com/szlcsc/YSX321SL-30MHZ-10PF-8PPM_C70576.pdf; Height: 0.8mm; Manufacturer_Part_Number: YSX321SL; SuppliersPartNumber: C9002

## Sheet RS485.SchDoc: RP2040 CNC
size B; Author: AM; CompanyName: Expatria Technologies; DrawnBy: A.Marles; Engineer: AM; Organization: Expatria Technolgoies; DocumentNumber: 3; Revision: A10; SheetNumber: 3; SheetTotal: 5
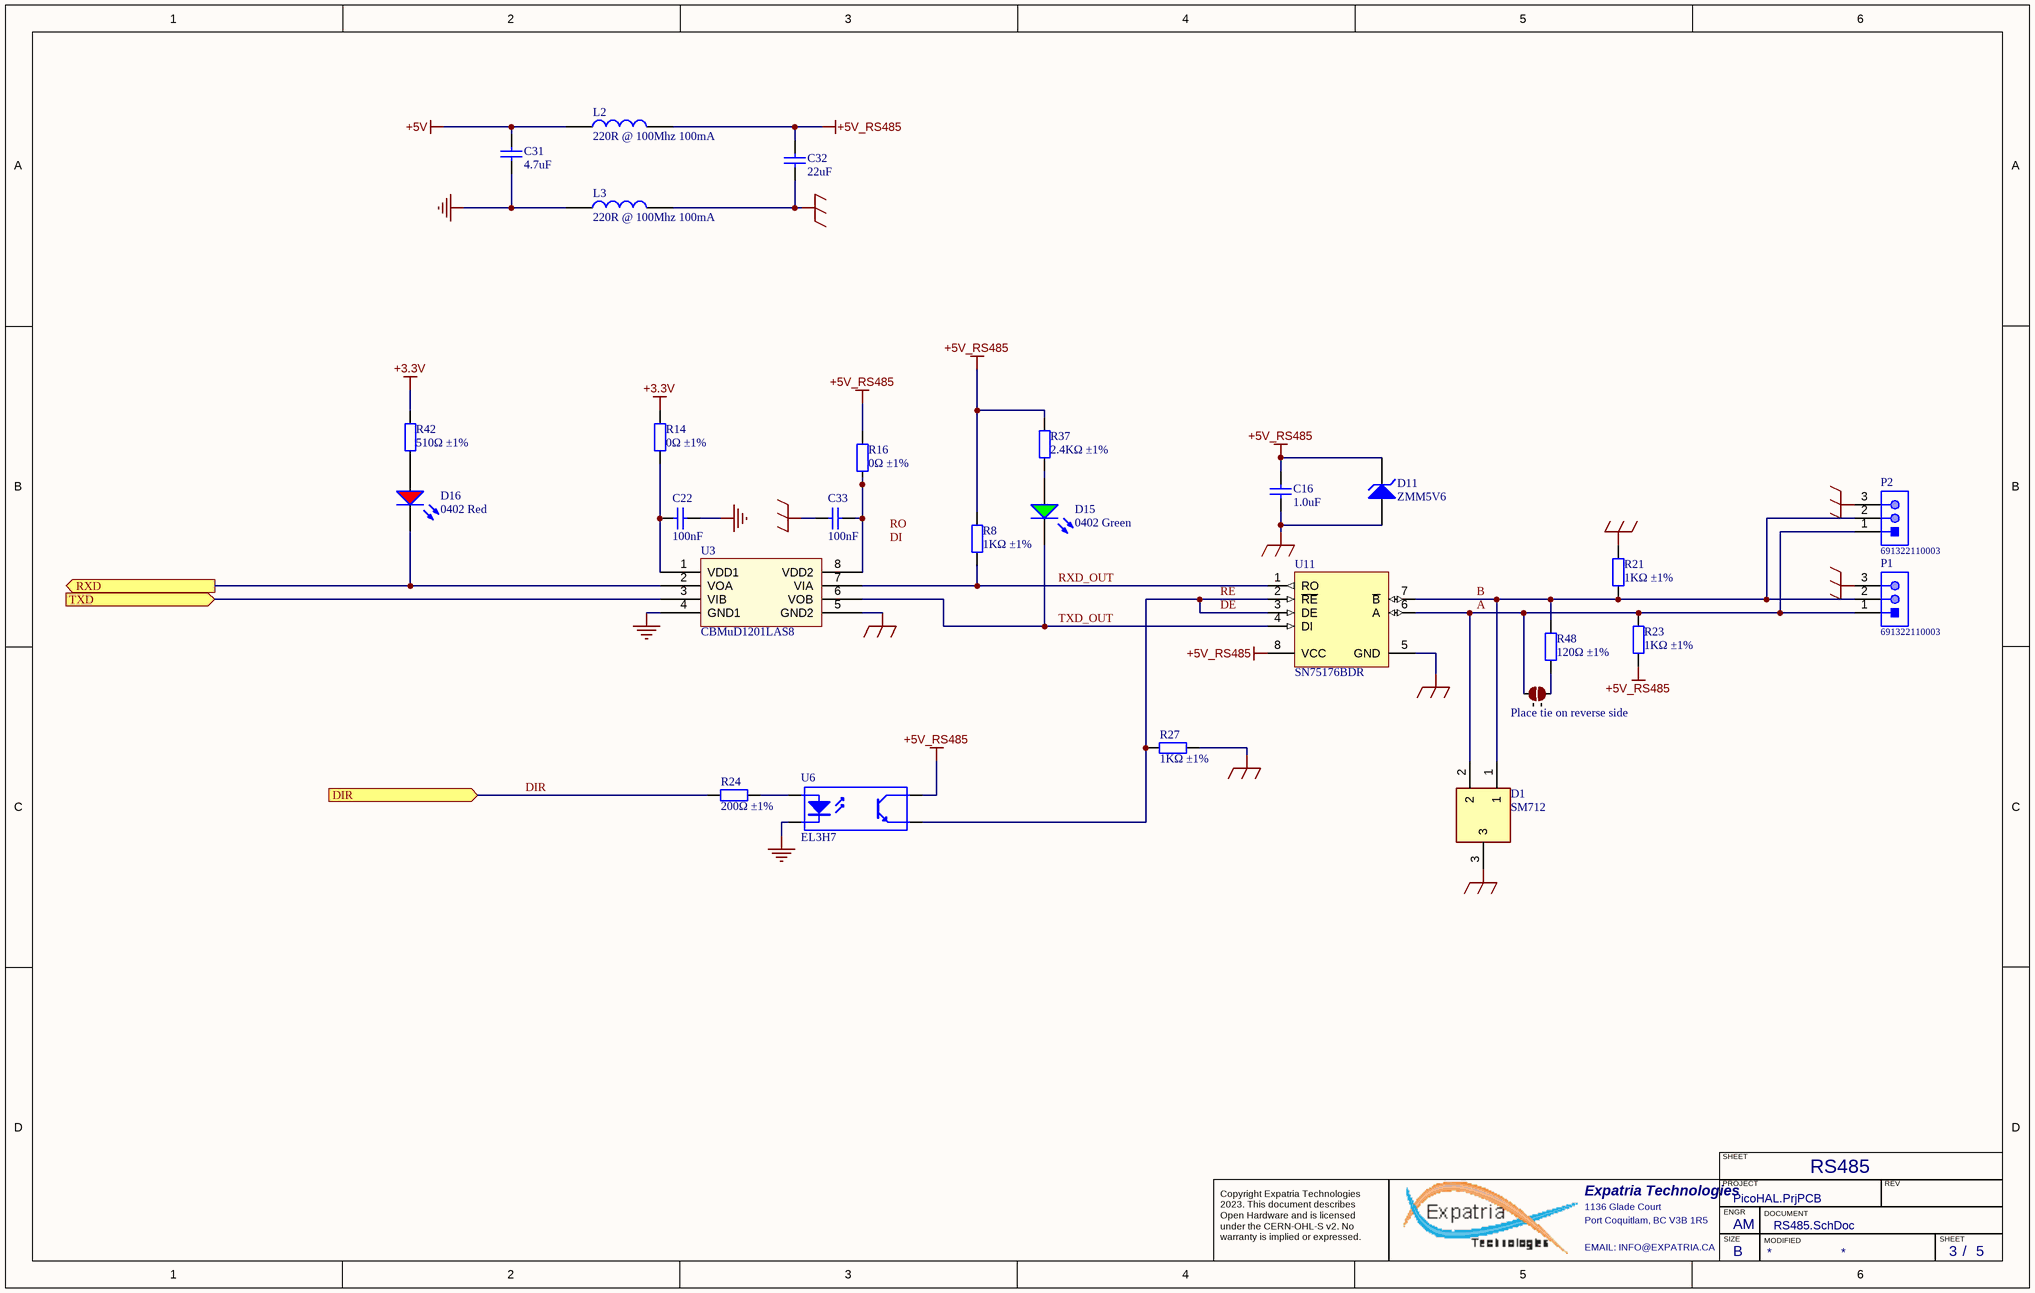
[diagram p3: RS485.SchDoc]

### Parts
C16  1.0uF  [0402_C]
C22  100nF  [0402_C]
C31  4.7uF  [0805_C]
C32  22uF  [0805_C]
C33  100nF  [0402_C]
D1  SM712  [SOT95P230X117-3N]
D11  ZMM5V6  [LL-34]
D15  0402 Green  [LED 0402_1005 RED]
D16  0402 Red  [LED 0402_1005 RED]
J4  2 way net solder junction - Normally Open  [2waySolder_NO]  (value not drawn)  (no BOM)
L2  220R @ 100Mhz 100mA  [0402_L]
L3  220R @ 100Mhz 100mA  [0402_L]
P1  691322110003  [691322110003]
P2  691322110003  [691322110003]
R8  1KΩ ±1%  [0402_R]
R14  0Ω ±1%  [0402_R]
R16  0Ω ±1%  [0402_R]
R21  1KΩ ±1%  [0402_R]
R23  1KΩ ±1%  [0402_R]
R24  200Ω ±1%  [0402_R]
R27  1KΩ ±1%  [0402_R]
R37  2.4KΩ ±1%  [0402_R]
R42  510Ω ±1%  [0402_R]
R48  120Ω ±1%  [0805_R]
U3  CBMuD1201LAS8  [SOIC-8_150mil]
U6  EL3H7  [SOIC127P700X200-4N]
U11  SN75176BDR  [SOIC-8_150mil]

### Ports
DIR (in), RXD (out), TXD (in)

### Nets
+3.3V: R14.2 R42.1
+5V: C31.2 L2.1
+5V_RS485: C16.2 C32.2 D11.2(K) L2.2 R8.2 R16.2 R23.1 R37.2 U6.4(C) U11.8(VCC)
GND: C22.2 C31.1 L3.1 U3.4(GND1) U6.2(K)
MOD_GND: C16.1 C32.1 C33.1 D1.3 D11.1(A) L3.2 P1.3 P2.3 R21.2 R27.2 U3.5(GND2) U11.5(GND)
A: D1.2 J4.1 P1.1 P2.1 R23.2 U11.6(A)
B: D1.1 P1.2 P2.2 R21.1 R48.2 U11.7(~{B})
DE: R27.1 U6.3(E) U11.2(~{RE}) U11.3(DE)  [also labelled RE]
DIR: R24.2 ; port DIR  [project net MOD_DIR]
RXD_OUT: R8.1 U3.7(VIA) U11.1(RO)
TXD_OUT: D15.K U3.6(VOB) U11.4(DI)
UART1_RX: D16.K U3.2(VOA) ; port RXD
UART1_TX: U3.3(VIB) ; port TXD
NetC22_1: C22.1 R14.1 U3.1(VDD1)
NetC33_2: C33.2 R16.1 U3.8(VDD2)
NetD15_A: D15.A R37.1
NetD16_A: D16.A R42.2
NetJ4_2: J4.2 R48.1
NetR24_1: R24.1 U6.1(A)

### Notes on the sheet
- (near J4) Place tie on reverse side
- RS485
- Labels drawn without touching a wire or pin: DI, RO
- SHEET
- Expatria Technologies
- 1136 Glade Court
- Port Coquitlam, BC V3B 1R5
- PROJECT
- SIZE
- ENGR
- MODIFIED
- DOCUMENT
- REV
- Copyright Expatria Technologies 2023. This document describes Open Hardware and is licensed under the CERN-OHL-S v2. No warranty is implied or expressed.
- EMAIL: INFO@EXPATRIA.CA
- B
- /

### Library data of the parts
C16 = 0402 1.0uF (105) 10% 25V: as C9 on sheet PicoHAL; ComponentLink1Description: Supplier link; ComponentLink1URL: http://www.szlcsc.com/product/details_53938.html; Package: 0402; Supplier: LC; SuppliersPartNumber: C52923
C22 C33 = 0402 100nF (104) 10% 16V: as C1 on sheet PicoHAL; ComponentLink1Description: Supplier link; ComponentLink1URL: http://www.szlcsc.com/product/details_1877.html; Package: 0402; Supplier: LC; SuppliersPartNumber: C1525; Capacitance: 100nF
C31 = 0805 4.7uF (475) 10% 25V: Chip capacitors; Manufacturer: Samsung Electro-Mechanics; PartNumber: CL21A475KAQNNNE; Tolerance: 10%; Voltage: 25V; ComponentLink1Description: Supplier link; ComponentLink1URL: http://www.szlcsc.com/product/details_2131.html; Package: 0805; Supplier: LC; SuppliersPartNumber: C1779; Capacitance: 4.7uF
C32 = 0805 22uF (226) 20% 25V: as C24 on sheet PicoHAL; ComponentLink1Description: Supplier link; ComponentLink1URL: http://www.szlcsc.com/product/details_46786.html; Package: 0805; Supplier: LC; SuppliersPartNumber: C45783; Capacitance: 22uF
D1 = CDSOT23-SM712: Bidirectional 12V (Max), 7V (Max) 7.5V / 13.3V 10V / 20V 12A(8/20us) SOT-23-3 TVS RoHS; Manufacturer_Name: DOWO; Height: 1.17mm; Manufacturer_Part_Number: SM712; SuppliersPartNumber: C293966
D11 = LL-34 ZMM5V6: as D9 on sheet PicoHAL; ComponentLink1Description: 供应商链接; ComponentLink1URL: http://www.szlcsc.com/product/details_8541.html; Package: LL-34; Supplier: LC; SuppliersPartNumber: C8062
D15 = 0402 LED Green: LED; Package: 0402; Supplier: LC; SuppliersPartNumber: C130723; Color: Green
D16 = 0402 LED Red: LED; Package: 0402; Supplier: LC; SuppliersPartNumber: C130720; Color: Red
J4 = 2waySolderNO: ComponentLink1URL: http://www.edatools.cz/addons; ComponentLink1Description: Source
L2 L3 = 0402 220R@100Mhz 0.1A: Ferrite Bead; Notepad: *; Package: 0402; Supplier: LC; SuppliersPartNumber: C92617
P1 = CMP-1502-01792-1: Serie 3221 - 3.50mm Horizontal PCB Header WR-TBL, 3 pin; Manufacturer: Wurth Elektronik; Pin Number: 3; Gender: Male; Part Number: 691322110003; Pitch: 3.50mm; Manufacturer URL: http://www.we-online.de; Packaging: Box; Operating Temperature: -40to105degC; Datasheet URL: http://katalog.we-online.de/em/datasheet/6913221100xx.pdf; Publisher: WurthElektronik; Mounting Technology: THT; Package Reference: 691322110003; SuppliersPartNumber: C430551
P2 = CMP-1502-01792-1: as P9 on sheet PicoHAL; SuppliersPartNumber: C880573
R8 R21 R23 R27 = 0402 1K (1001) 1%: as R2 on sheet PicoHAL; ComponentLink1Description: Supplier link; ComponentLink1URL: http://www.szlcsc.com/product/details_12256.html; Package: 0402; Supplier: LC; SuppliersPartNumber: C11702; Resistance: 1KΩ; Tolerance: 1%
R14 R16 = 0402 0R (0R0) 1%: Chip resistor; Manufacturer: Uniroyal Elec; PartNumber: 0402WGF0000TCE; Power: 1/16W; Package: 0402; Supplier: LC; SuppliersPartNumber: C17168; Resistance: 0Ω; Tolerance: 1%; ComponentLink1Description: Supplier link; ComponentLink1URL: http://www.szlcsc.com/product/details_17853.html
R24 = 0402 200R (2000) 1%: Chip resistor; Manufacturer: Uniroyal Elec; PartNumber: 0402WGF2000TCE; Power: 1/16W; Package: 0402; Supplier: LC; SuppliersPartNumber: C25087; Resistance: 200Ω; Tolerance: 1%; ComponentLink1Description: Supplier link; ComponentLink1URL: http://www.szlcsc.com/product/details_25830.html
R37 = 0402 2.4K (2401) 1%: Chip resistor; Manufacturer: Uniroyal Elec; PartNumber: 0402WGF2401TCE; Power: 1/16W; ComponentLink1Description: Supplier link; ComponentLink1URL: http://www.szlcsc.com/product/details_26625.html; Package: 0402; Supplier: LC; SuppliersPartNumber: C25882; Resistance: 2.4KΩ; Tolerance: 1%
R42 = 0402 510R (5100) 1%: as R9 on sheet PicoHAL; Package: 0402; Supplier: LC; SuppliersPartNumber: C25123; Resistance: 510Ω; Tolerance: 1%
R48 = 0805 120R (1200) 1%: Chip resistor; Manufacturer: Uniroyal Elec; Power: 1/8W; ComponentLink1Description: Supplier link; ComponentLink1URL: http://www.szlcsc.com/product/details_18125.html; Package: 0805; Supplier: LC; SuppliersPartNumber: C17437; Tolerance: 1%
U3 = CBMuD1201LAS8: Dual Channel Isolator; Package: SOIC-8_150mil; Supplier: LC; SuppliersPartNumber: C476472; ComponentLink1Description: 供应商链接; ComponentLink1URL: http://www.szlcsc.com/product/details_10199.html
U6 = EL3H7(C)(TA)-G_[C92243]: 80V -55℃~+110℃ 50mA 3us@2mA,100Ω 5us@2mA,100Ω 0.1V@1mA,10mA 1 6V 1.2V 光电三极管 DC 3750V SSOP-4 Optocouplers - Phototransistor Output ROHS; ComponentLink1Description: 供应商链接; ComponentLink1URL: http://www.szlcsc.com/product/details_7114.html; Package: SSOP-4; Supplier: LC; SuppliersPartNumber: C92243
U11 = SN75176BDR_[C7063]: RS-485/RS-422; ComponentLink1Description: 供应商链接; ComponentLink1URL: http://www.szlcsc.com/product/details_7535.html; Package: SOIC-8_150mil; Supplier: LC; SuppliersPartNumber: C7063

## Sheet 5V_Power_Supply.SchDoc: STM32F446 CNC
size B; Author: AM; CompanyName: Expatria Technologies; DrawnBy: A.Marles; Engineer: AM; Organization: Expatria Technolgoies; DocumentNumber: 9; Revision: A10; SheetNumber: 8; SheetTotal: 7
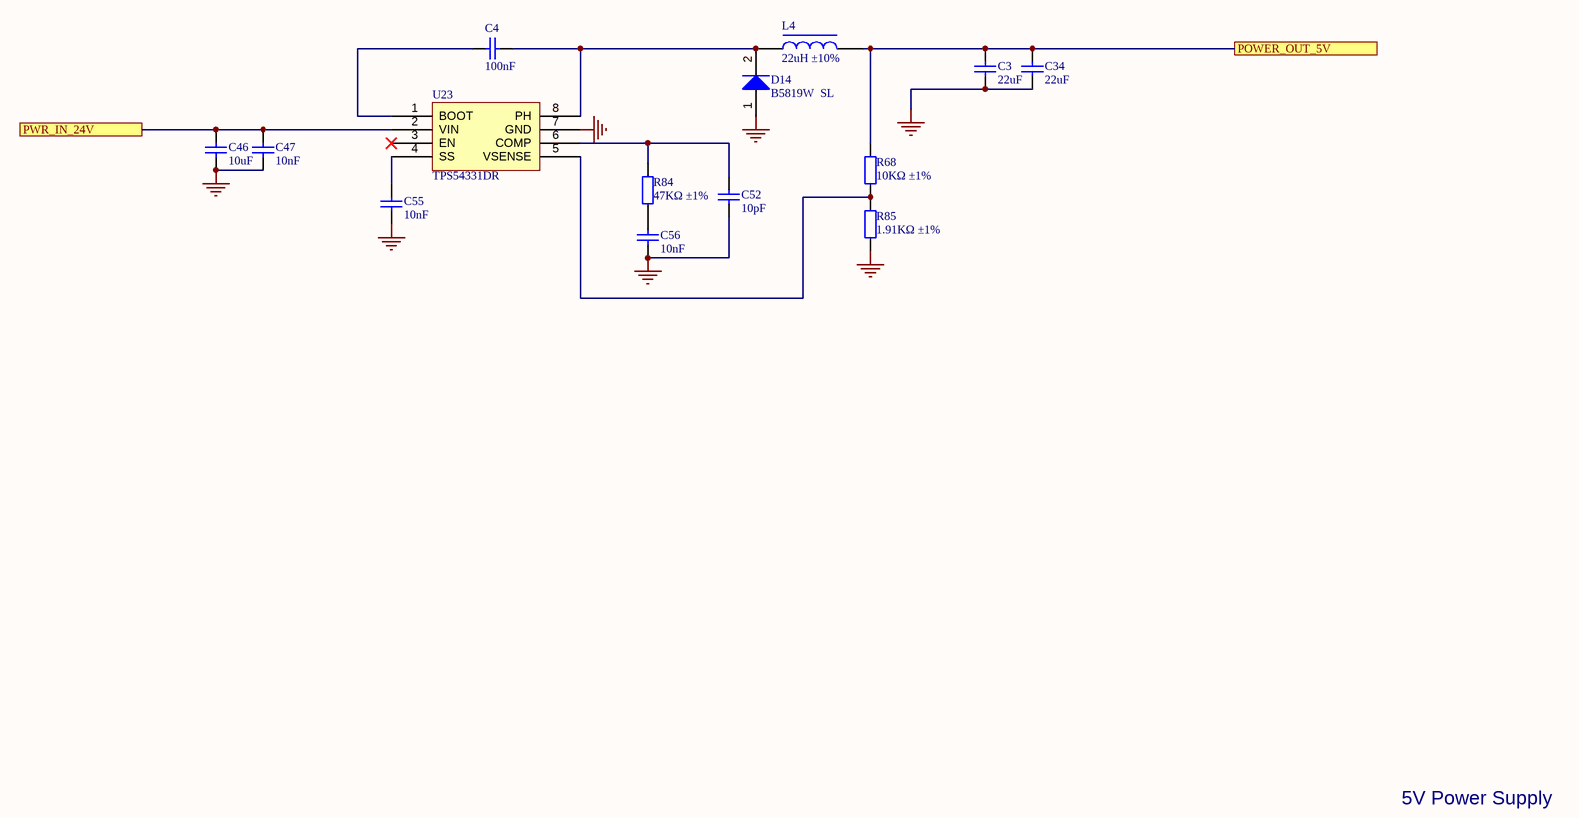
[diagram p4: 5V_Power_Supply.SchDoc]

### Parts
C3  22uF  [0805_C]
C4  100nF  [0402_C]
C34  22uF  [0805_C]
C46  10uF  [1206_C]
C47  10nF  [0402_C]
C52  10pF  [0402_C]
C55  10nF  [0402_C]
C56  10nF  [0402_C]
D14  B5819W  SL  [SOD-123]
L4  22uH ±10%  [INDP4040X30N]
R68  10KΩ ±1%  [0603_R]
R84  47KΩ ±1%  [0402_R]
R85  1.91KΩ ±1%  [0603_R]
U23  TPS54331DR  [SOIC-8_150mil]

### Ports
POWER_OUT_5V, PWR_IN_24V

### Nets
+5V: C3.2 C34.2 L4.2 R68.2 ; port POWER_OUT_5V
GND: C3.1 C34.1 C46.1 C47.1 C52.1 C55.1 C56.1 D14.1(A) R85.1 U23.7(GND)
Relay_VCC: C46.2 C47.2 U23.2(VIN) ; port PWR_IN_24V
NetC4_1: C4.1 U23.1(BOOT)
NetC4_2: C4.2 D14.2(K) L4.1 U23.8(PH)
NetC52_2: C52.2 R84.2 U23.6(COMP)
NetC55_2: C55.2 U23.4(SS)
NetC56_2: C56.2 R84.1
NetR68_1: R68.1 R85.2 U23.5(VSENSE)

Not connected (* = marked no-connect by the designer): U23 3(EN)*

### Notes on the sheet
- 5V Power Supply
- SHEET
- Expatria Technologies
- 1136 Glade Court
- Port Coquitlam, BC V3B 1R5
- PROJECT
- SIZE
- ENGR
- MODIFIED
- DOCUMENT
- REV
- Copyright Expatria Technologies 2023. This document describes Open Hardware and is licensed under the CERN-OHL-S v2. No warranty is implied or expressed.
- EMAIL: INFO@EXPATRIA.CA
- B
- /

### Library data of the parts
C3 C34 = 0805 22uF (226) 20% 25V: as C24 on sheet PicoHAL; Package: 0805; Supplier: LC; SuppliersPartNumber: C2922481; Capacitance: 22uF; ComponentLink1Description: Supplier link; ComponentLink1URL: http://www.szlcsc.com/product/details_46786.html
C4 = 0402 100nF (104) 10% 16V: as C1 on sheet PicoHAL; Package: 0402; Supplier: LC; SuppliersPartNumber: C1525; Capacitance: 100nF; ComponentLink1Description: Supplier link; ComponentLink1URL: http://www.szlcsc.com/product/details_1877.html
C46 = 1206 10uF (106) 10% 50V: Chip capacitors; Manufacturer: Samsung Electro-Mechanics; PartNumber: CL31A106KBHNNNE; Tolerance: 10%; Voltage: 50V; Package: 1206; Supplier: LC; SuppliersPartNumber: C13585; Capacitance: 10uF; Manufacturer 1: Samsung Electro-Mechanics
C47 C55 C56 = 0402 10nF (103) 10% 50V: Chip capacitors; Manufacturer: Samsung Electro-Mechanics; PartNumber: CL05B103KB5NNNC; Tolerance: 10%; Voltage: 50V; Package: 0402; Supplier: LC; SuppliersPartNumber: C15195; Capacitance: 10nF; ComponentLink1Description: Supplier link; ComponentLink1URL: http://www.szlcsc.com/product/details_15869.html
C52 = 0402 10pF (100) 5% 50V: Chip capacitors; Manufacturer: Samsung Electro-Mechanics; PartNumber: CL05C100JB5NNNC; Tolerance: 5%; Voltage: 50V; Package: 0402; Supplier: LC; SuppliersPartNumber: C32949; Capacitance: 10pF; ComponentLink1Description: Supplier link; ComponentLink1URL: http://www.szlcsc.com/product/details_33914.html
D14 = SOD-123 B5819W  SL: Schottky Diode; ComponentLink1Description: 供应商链接; ComponentLink1URL: http://www.szlcsc.com/product/details_9093.html; Package: SOD-123; Supplier: LC; SuppliersPartNumber: C8598
L4 = 4x4x3 22uH 20%: 1A 22uH ±20% SMD,4x4x3mm Power Inductors ROHS; Package: SMD,4x4x3mm; Supplier: LC; SuppliersPartNumber: C167883
R68 = 0603 10K (1002) 1%: Chip resistor; Manufacturer: Uniroyal Elec; PartNumber: 0603WAF1002T5E; Power: 1/10W; Package: 0603; Supplier: LC; SuppliersPartNumber: C25804; Resistance: 10KΩ; Tolerance: 1%; ComponentLink1Description: Supplier link; ComponentLink1URL: http://www.szlcsc.com/product/details_26547.html
R84 = 0402 47K (4702) 1%: Chip resistor; Manufacturer: Uniroyal Elec; PartNumber: 0402WGF4702TCE; Power: 1/16W; Package: 0402; Supplier: LC; SuppliersPartNumber: C25792; Resistance: 47KΩ; Tolerance: 1%; ComponentLink1Description: Supplier link; ComponentLink1URL: http://www.szlcsc.com/product/details_26535.html
R85 = 0603 2K (2001) 1%: Chip resistor; Manufacturer: Uniroyal Elec; PartNumber: 0603WAF1911T5E; Power: 1/10W; Package: 0603; Supplier: LC; SuppliersPartNumber: C22853; Resistance: 1.91KΩ; Tolerance: 1%; ComponentLink1Description: Supplier link; ComponentLink1URL: http://www.szlcsc.com/product/details_23702.html
U23 = TPS54331DR_[C9865]: Switching Voltage Regulators 3A 28V In Step Down SWIFT DC/DC Cnvrtr; Package: SOIC-8_150mil; Supplier: LC; SuppliersPartNumber: C9865

## Sheet W5500_Module.SchDoc: RP2040 CNC
size C; Author: AM; CompanyName: Expatria Technologies; DrawnBy: A.Marles; Engineer: AM; Organization: Expatria Technolgoies; Address1: Schematic; DocumentNumber: 2; Revision: A10; SheetNumber: 5; SheetTotal: 9
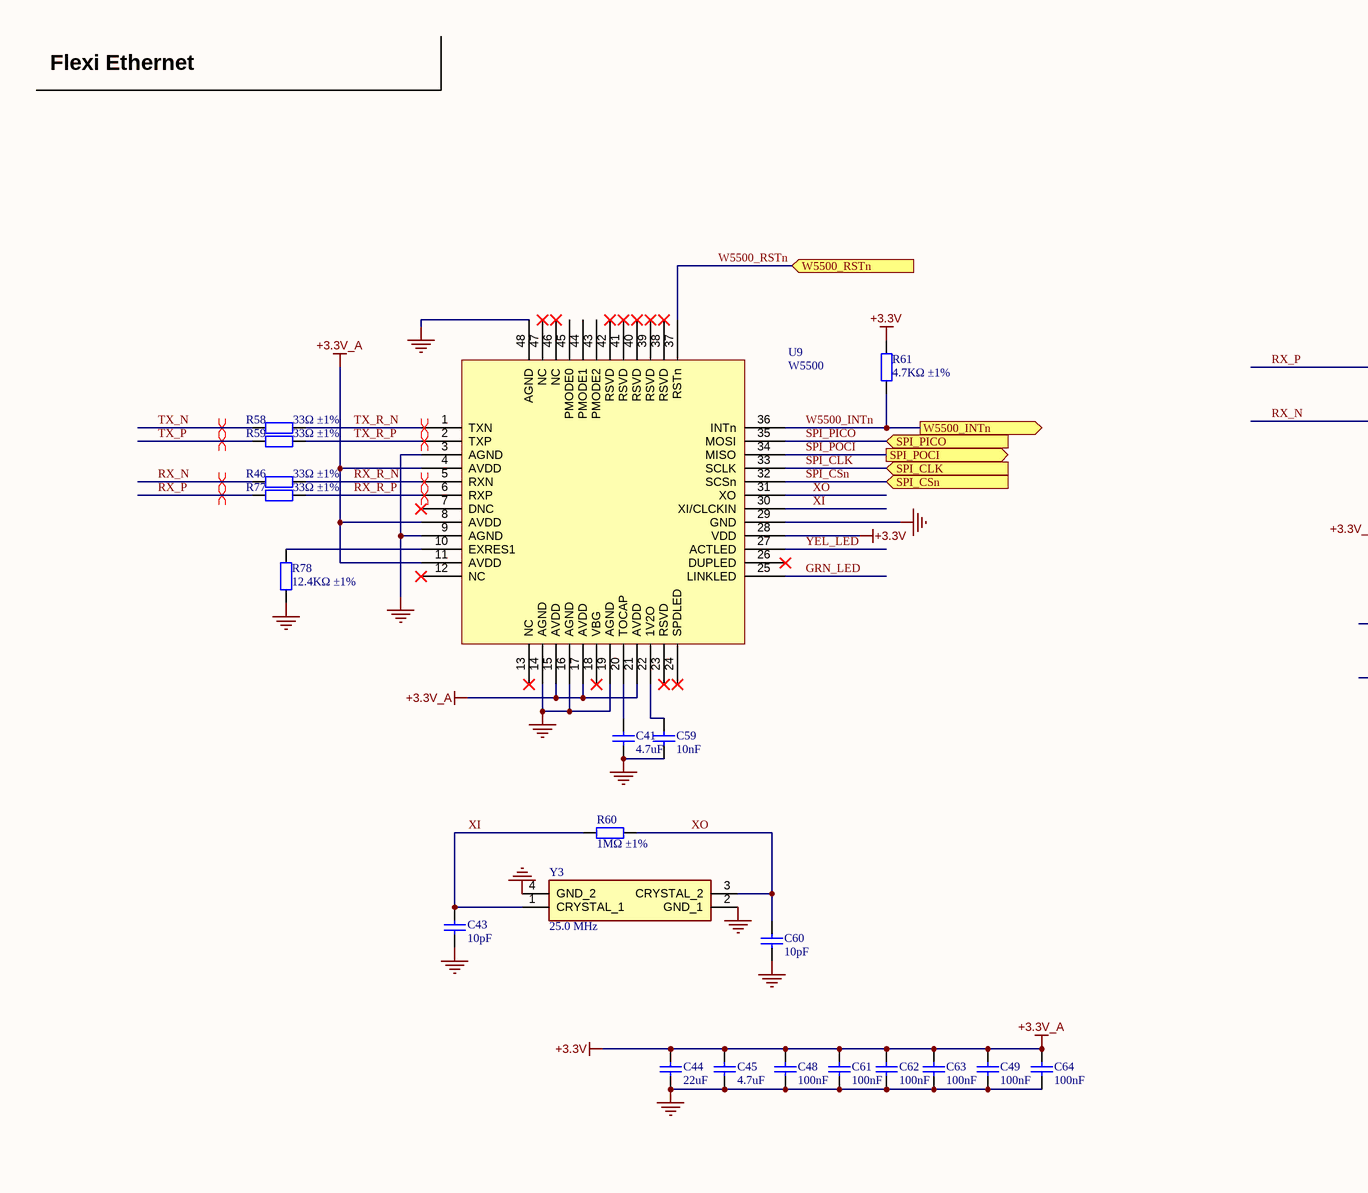
[diagram p5: W5500_Module.SchDoc, left]
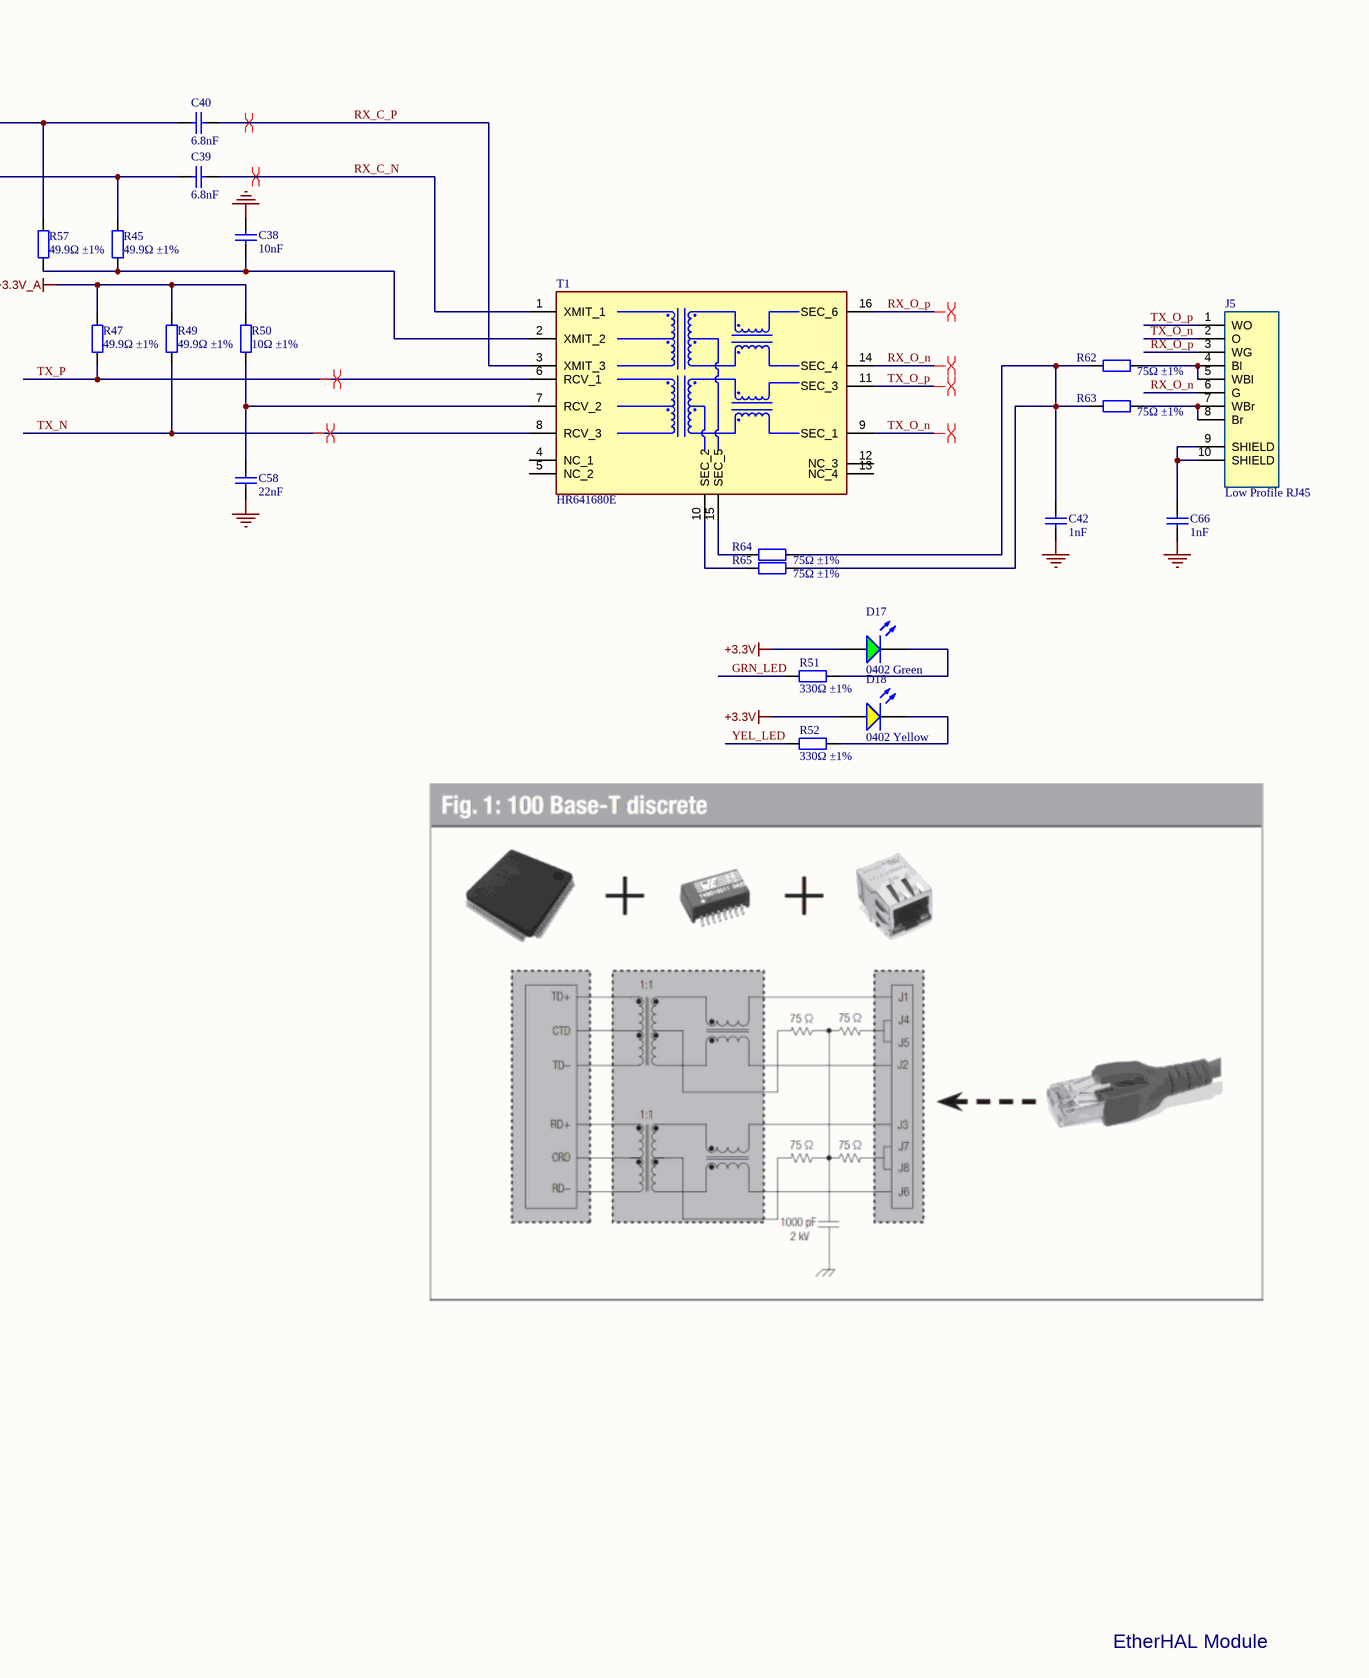
[diagram p6: W5500_Module.SchDoc, right]

### Parts
C38  10nF  [0402_C]
C39  6.8nF  [0402_C]
C40  6.8nF  [0402_C]
C41  4.7uF  [0402_C]
C42  1nF  [1206_C]
C43  10pF  [0402_C]
C44  22uF  [0805_C]
C45  4.7uF  [0603_C]
C48  100nF  [0402_C]
C49  100nF  [0402_C]
C58  22nF  [0402_C]
C59  10nF  [0402_C]
C60  10pF  [0402_C]
C61  100nF  [0402_C]
C62  100nF  [0402_C]
C63  100nF  [0402_C]
C64  100nF  [0402_C]
C66  1nF  [1206_C]
D17  0402 Green  [LED 0402_1005 RED]
D18  0402 Yellow  [LED 0402_1005 RED]
J5  Low Profile RJ45  [RJ45-SMD_MJ88-B011-HLSV6-P]
R45  49.9Ω ±1%  [0402_R]
R46  33Ω ±1%  [0402_R]
R47  49.9Ω ±1%  [0402_R]
R49  49.9Ω ±1%  [0402_R]
R50  10Ω ±1%  [0402_R]
R51  330Ω ±1%  [0402_R]
R52  330Ω ±1%  [0402_R]
R57  49.9Ω ±1%  [0402_R]
R58  33Ω ±1%  [0402_R]
R59  33Ω ±1%  [0402_R]
R60  1MΩ ±1%  [0402_R]
R61  4.7KΩ ±1%  [0402_R]
R62  75Ω ±1%  [0402_R]
R63  75Ω ±1%  [0402_R]
R64  75Ω ±1%  [0402_R]
R65  75Ω ±1%  [0402_R]
R77  33Ω ±1%  [0402_R]
R78  12.4KΩ ±1%  [0603_R]
T1  HR641680E  [HR641680E]
U9  W5500  [LQFP-48_7x7x05P]
Y3  25.0 MHz  [YSX321SL]

### Ports
SPI_CLK (in), SPI_CSn (in), SPI_PICO (in), SPI_POCI (out), W5500_INTn (out), W5500_RSTn (in)

### Nets
+3.3V: C44.2 C45.2 C48.2 C49.2 C61.2 C62.2 C63.2 C64.2 D17.A D18.A R47.1 R49.1 R50.1 R61.1 U9.4(AVDD) U9.8(AVDD) U9.11(AVDD) U9.15(AVDD) U9.17(AVDD) U9.21(AVDD) U9.28(VDD)  [also labelled +3.3V_A]
GND: C38.1 C41.1 C42.1 C43.1 C44.1 C45.1 C48.1 C49.1 C58.1 C59.1 C60.1 C61.1 C62.1 C63.1 C64.1 C66.1 R78.1 U9.3(AGND) U9.9(AGND) U9.14(AGND) U9.16(AGND) U9.19(AGND) U9.29(GND) U9.48(AGND) Y3.2(GND_1) Y3.4(GND_2)
GRN_LED: R51.1 U9.25(LINKLED)
RX_C_N: C39.1 T1.1(XMIT_1)
RX_C_P: C40.1 T1.3(XMIT_3)
RX_N: C39.2 R45.2 R46.1
RX_O_n: J5.6(G) T1.14(SEC_4)
RX_O_p: J5.3(WG) T1.16(SEC_6)
RX_P: C40.2 R57.2 R77.1
RX_R_N: R46.2 U9.5(RXN)
RX_R_P: R77.2 U9.6(RXP)
SPI_CLK: U9.33(SCLK) ; port SPI_CLK
SPI_CSn: U9.32(SCSn) ; port SPI_CSn
SPI_PICO: U9.35(MOSI) ; port SPI_PICO
SPI_POCI: U9.34(MISO) ; port SPI_POCI
TX_N: R49.2 R58.1 T1.8(RCV_3)
TX_O_n: J5.2(O) T1.9(SEC_1)
TX_O_p: J5.1(WO) T1.11(SEC_3)
TX_P: R47.2 R59.1 T1.6(RCV_1)
TX_R_N: R58.2 U9.1(TXN)
TX_R_P: R59.2 U9.2(TXP)
W5500_INTn: R61.2 U9.36(INTn) ; port W5500_INTn
W5500_RSTn: U9.37(RSTn) ; port W5500_RSTn  [project net PICO_RUN]
XI: C43.2 R60.1 U9.30(XI/CLCKIN) Y3.1(CRYSTAL_1)
XO: C60.2 R60.2 U9.31(XO) Y3.3(CRYSTAL_2)
YEL_LED: R52.1 U9.27(ACTLED)
NetC38_2: C38.2 R45.1 R57.1 T1.2(XMIT_2)
NetC41_2: C41.2 U9.20(TOCAP)
NetC42_2: C42.2 R62.2 R63.2 R64.1 R65.1
NetC58_2: C58.2 R50.2 T1.7(RCV_2)
NetC59_2: C59.2 U9.22(1V2O)
NetC66_2: C66.2 J5.9(SHIELD) J5.10(SHIELD)
NetD17_K: D17.K R51.2
NetD18_K: D18.K R52.2
NetJ5_4: J5.4(Bl) J5.5(WBl) R62.1
NetJ5_7: J5.7(WBr) J5.8(Br) R63.1
NetR64_2: R64.2 T1.15(SEC_5)
NetR65_2: R65.2 T1.10(SEC_2)
NetR78_2: R78.2 U9.10(EXRES1)

Not connected (* = marked no-connect by the designer): T1 4(NC_1) 5(NC_2) 12(NC_3) 13(NC_4); U9 7(DNC)* 12(NC)* 13(NC)* 18(VBG)* 23(RSVD)* 24(SPDLED)* 26(DUPLED)* 38(RSVD)* 39(RSVD)* 40(RSVD)* 41(RSVD)* 42(RSVD)* 43(PMODE2) 44(PMODE1) 45(PMODE0) 46(NC)* 47(NC)*

### Layout directives
differential pair: RX_C_N, RX_C_P, RX_N, RX_O_n, RX_O_p, RX_P, RX_R_N, RX_R_P, TX_N, TX_O_n, TX_O_p, TX_P, TX_R_N, TX_R_P

### Notes on the sheet
- Flexi Ethernet
- EtherHAL Module
- Expatria Technologies
- SHEET
- PROJECT
- REV
- 1136 Glade Court
- Port Coquitlam, BC V3B 1R5
- EMAIL: INFO@EXPATRIA.CA
- SIZE
- ENGR
- C
- MODIFIED
- DOCUMENT
- /
- Copyright Expatria Technologies 2021.  This document describes Open Hardware and is licensed under the CERN-OHL-P  v2.  No warranty is implied or expressed.

### Library data of the parts
C38 C59 = 0402 10nF (103) 10% 50V: as C47 on sheet 5V_Power_Supply; ComponentLink1Description: Supplier link; ComponentLink1URL: http://www.szlcsc.com/product/details_15869.html; Package: 0402; Supplier: LC; SuppliersPartNumber: C15195; Capacitance: 10nF
C39 C40 = 0402 6.8nF (682) 10% 50V: Chip capacitors; Manufacturer: Guangdong Fenghua Advanced Tech; PartNumber: 0402B682K500NT; Tolerance: 10%; Voltage: 50V; ComponentLink1Description: Supplier link; ComponentLink1URL: http://www.szlcsc.com/product/details_1894.html; Package: 0402; Supplier: LC; SuppliersPartNumber: C1542; Capacitance: 6.8nF
C41 = 0402 4.7uF (475) 20% 10V: as C2 on sheet PicoHAL; ComponentLink1Description: Supplier link; ComponentLink1URL: http://www.szlcsc.com/product/details_24469.html; Package: 0402; Supplier: LC; SuppliersPartNumber: C23733; Capacitance: 4.7uF
C42 C66 = 1206 1nF (102) 10% 500V: Chip capacitors; Manufacturer: Samsung Electro-Mechanics; PartNumber: CL31B102KGFNNNE; Tolerance: 10%; Voltage: 500V; ComponentLink1Description: Supplier link; ComponentLink1URL: http://www.szlcsc.com/product/details_36187.html; Package: 1206; Supplier: LC; SuppliersPartNumber: C35216; Capacitance: 1nF
C43 C60 = 0402 10pF (100) 5% 50V: as C52 on sheet 5V_Power_Supply; ComponentLink1Description: Supplier link; ComponentLink1URL: http://www.szlcsc.com/product/details_33914.html; Package: 0402; Supplier: LC; SuppliersPartNumber: C32949; Capacitance: 10pF
C44 = 0805 22uF (226) 20% 25V: as C24 on sheet PicoHAL; ComponentLink1Description: Supplier link; ComponentLink1URL: http://www.szlcsc.com/product/details_46786.html; Package: 0805; Supplier: LC; SuppliersPartNumber: C2922481; Capacitance: 22uF
C45 = 0603 4.7uF (475) 10% 16V: Chip capacitors; Manufacturer: Samsung Electro-Mechanics; PartNumber: CL10A475KO8NNNC; Tolerance: 10%; Voltage: 16V; ComponentLink1Description: Supplier link; ComponentLink1URL: http://www.szlcsc.com/product/details_20375.html; Package: 0603; Supplier: LC; SuppliersPartNumber: C19666; Capacitance: 4.7uF
C48 C49 C61-C64 = 0402 100nF (104) 10% 16V: as C1 on sheet PicoHAL; ComponentLink1Description: Supplier link; ComponentLink1URL: http://www.szlcsc.com/product/details_1877.html; Package: 0402; Supplier: LC; SuppliersPartNumber: C1525; Capacitance: 100nF
C58 = 0402 22nF (223) 10% 50V: Chip capacitors; Manufacturer: Guangdong Fenghua Advanced Tech; PartNumber: 0402B223K500NT; Tolerance: 10%; Voltage: 50V; ComponentLink1Description: Supplier link; ComponentLink1URL: http://www.szlcsc.com/product/details_1884.html; Package: 0402; Supplier: LC; SuppliersPartNumber: C1532; Capacitance: 22nF
D17 = 0402 LED Green: LED; Package: 0402; Supplier: LC; SuppliersPartNumber: C130723; Color: Green
D18 = 0402 LED Yellow: LED; ComponentLink1Description: 供应商链接; ComponentLink1URL: http://www.szlcsc.com/product/details_73147.html; Package: 0402; Supplier: LC; SuppliersPartNumber: C130721; Color: Yellow
J5 = MJ88-B011-HLSV6-P: Micro USB; MF: Heling; SuppliersPartNumber: C501463; Part+Number: MJ88-B011-HLSV6-P
R45 R47 R49 R57 = 0402 49.9R (49R9) 1%: Chip resistor; Manufacturer: Uniroyal Elec; PartNumber: 0402WGF499JTCE; Power: 1/16W; ComponentLink1Description: Supplier link; ComponentLink1URL: http://www.szlcsc.com/product/details_25863.html; Package: 0402; Supplier: LC; SuppliersPartNumber: C25120; Resistance: 49.9Ω; Tolerance: 1%
R46 R58 R59 R77 = 0402 33R (33R0) 1%: Chip resistor; Manufacturer: Uniroyal Elec; PartNumber: 0402WGF330JTCE; Power: 1/16W; ComponentLink1Description: Supplier link; ComponentLink1URL: http://www.szlcsc.com/product/details_25848.html; Package: 0402; Supplier: LC; SuppliersPartNumber: C25105; Resistance: 33Ω; Tolerance: 1%
R50 = 0402 10R (10R0) 1%: Chip resistor; Manufacturer: Uniroyal Elec; PartNumber: 0402WGF100JTCE; Power: 1/16W; ComponentLink1Description: Supplier link; ComponentLink1URL: http://www.szlcsc.com/product/details_25820.html; Package: 0402; Supplier: LC; SuppliersPartNumber: C25077; Resistance: 10Ω; Tolerance: 1%
R51 R52 = 0402 330R (3300) 1%: Chip resistor; Manufacturer: Uniroyal Elec; PartNumber: 0402WGF3300TCE; Power: 1/16W; ComponentLink1Description: Supplier link; ComponentLink1URL: http://www.szlcsc.com/product/details_25847.html; Package: 0402; Supplier: LC; SuppliersPartNumber: C25104; Resistance: 330Ω; Tolerance: 1%
R60 = 0402 1M (1004) 1%: Chip resistor; Manufacturer: Uniroyal Elec; PartNumber: 0402WGF1004TCE; Power: 1/16W; ComponentLink1Description: Supplier link; ComponentLink1URL: http://www.szlcsc.com/product/details_26826.html; Package: 0402; Supplier: LC; SuppliersPartNumber: C26083; Resistance: 1MΩ; Tolerance: 1%
R61 = 0402 4.7K (4701) 1%: Chip resistor; Manufacturer: Uniroyal Elec; PartNumber: 0402WGF4701TCE; Power: 1/16W; ComponentLink1Description: Supplier link; ComponentLink1URL: http://www.szlcsc.com/product/details_26643.html; Package: 0402; Supplier: LC; SuppliersPartNumber: C25900; Resistance: 4.7KΩ; Tolerance: 1%
R62-R65 = 0402 75R (75R0) 1%: as R11 on sheet PicoHAL; ComponentLink1Description: Supplier link; ComponentLink1URL: http://www.szlcsc.com/product/details_25876.html; Package: 0402; Supplier: LC; SuppliersPartNumber: C25133; Resistance: 75Ω; Tolerance: 1%
R78 = 0603 10K (1002) 1%: Chip resistor; Manufacturer: Uniroyal Elec; PartNumber: 0603WAF1242T5E; Power: 1/10W; Resistance: 12.4K; ComponentLink1Description: Supplier link; ComponentLink1URL: http://www.szlcsc.com/product/details_26547.html; Package: 0603; Supplier: LC; SuppliersPartNumber: C22865; Tolerance: 1%
T1 = HR641680E: Transformer; Manufacturer_Name: Hanrun Electronics; Datasheet Link: https://datasheet.lcsc.com/szlcsc/Zhongshan-HanRun-Elec-HR641680E_C189555.pdf; Height: 5.715mm; Manufacturer_Part_Number: HR641680E
U9 = W5500_[C32843]: Ethernet Controllers 2.97V ~ 3.63V 10/100 Base-T/TX PHY SPI LQFP-48_7x7x05P Ethernet ICs ROHS; ComponentLink1Description: 供应商链接; ComponentLink1URL: http://www.szlcsc.com/product/details_33808.html; Package: LQFP-48_7x7x05P; Supplier: LC; SuppliersPartNumber: C32843
Y3 = YSX321SL: Crystal or Oscillator; Manufacturer_Name: Yangxing Tech; Manufacturer_Part_Number: X322525MSB4SI; Height: 0.8mm; SuppliersPartNumber: C13740

## Nets that join several sheets
+3.3V: PicoHAL (39 pins), RS485 (R14.2 R42.1), W5500_Module (21 pins)
+5V: PicoHAL (8 pins), RS485 (C31.2 L2.1), 5V_Power_Supply (C3.2 C34.2 L4.2 R68.2)
GND: PicoHAL (62 pins), RS485 (5 pins), 5V_Power_Supply (10 pins), W5500_Module (26 pins)
Relay_VCC: PicoHAL (D13.2 FUSE1.2), 5V_Power_Supply (C46.2 C47.2 U23.2)
MOD_DIR: PicoHAL (U1.39), RS485 (R24.2)
PICO_RUN: PicoHAL (6 pins), W5500_Module (U9.37)
SPI_CLK: PicoHAL (U1.4), W5500_Module (U9.33)
SPI_CSn: PicoHAL (U1.3), W5500_Module (U9.32)
SPI_PICO: PicoHAL (U1.5), W5500_Module (U9.35)
SPI_POCI: PicoHAL (U1.2), W5500_Module (U9.34)
UART1_RX: PicoHAL (U1.12), RS485 (D16.K U3.2)
UART1_TX: PicoHAL (U1.11), RS485 (U3.3)
W5500_INTn: PicoHAL (U1.6), W5500_Module (R61.2 U9.36)

## Assembly variants
SMT_ONLY: not fitted J1 J1_LS_A J1_LS_X J1_LS_Y J1_LS_Z J2_LS_A J2_LS_X J2_LS_Y J2_LS_Z J3_PH_CY J3_PH_DR J3_PH_FD J3_PH_HLT J3_PH_PR J5 P1 P1 P2 P2 P3 P3 P4 P4 P5 P5 P6 P6 P7 P7 P8 P8 P9 P10 P10 P12_STP_A P12_STP_X P12_STP_Y P12_STP_Z P13 R7_LS_X
FULL_PLACE: not fitted P7 R16 R16 R30 R30